# EAGLE design dcmotor_controller (EAGLE 9.0.0)
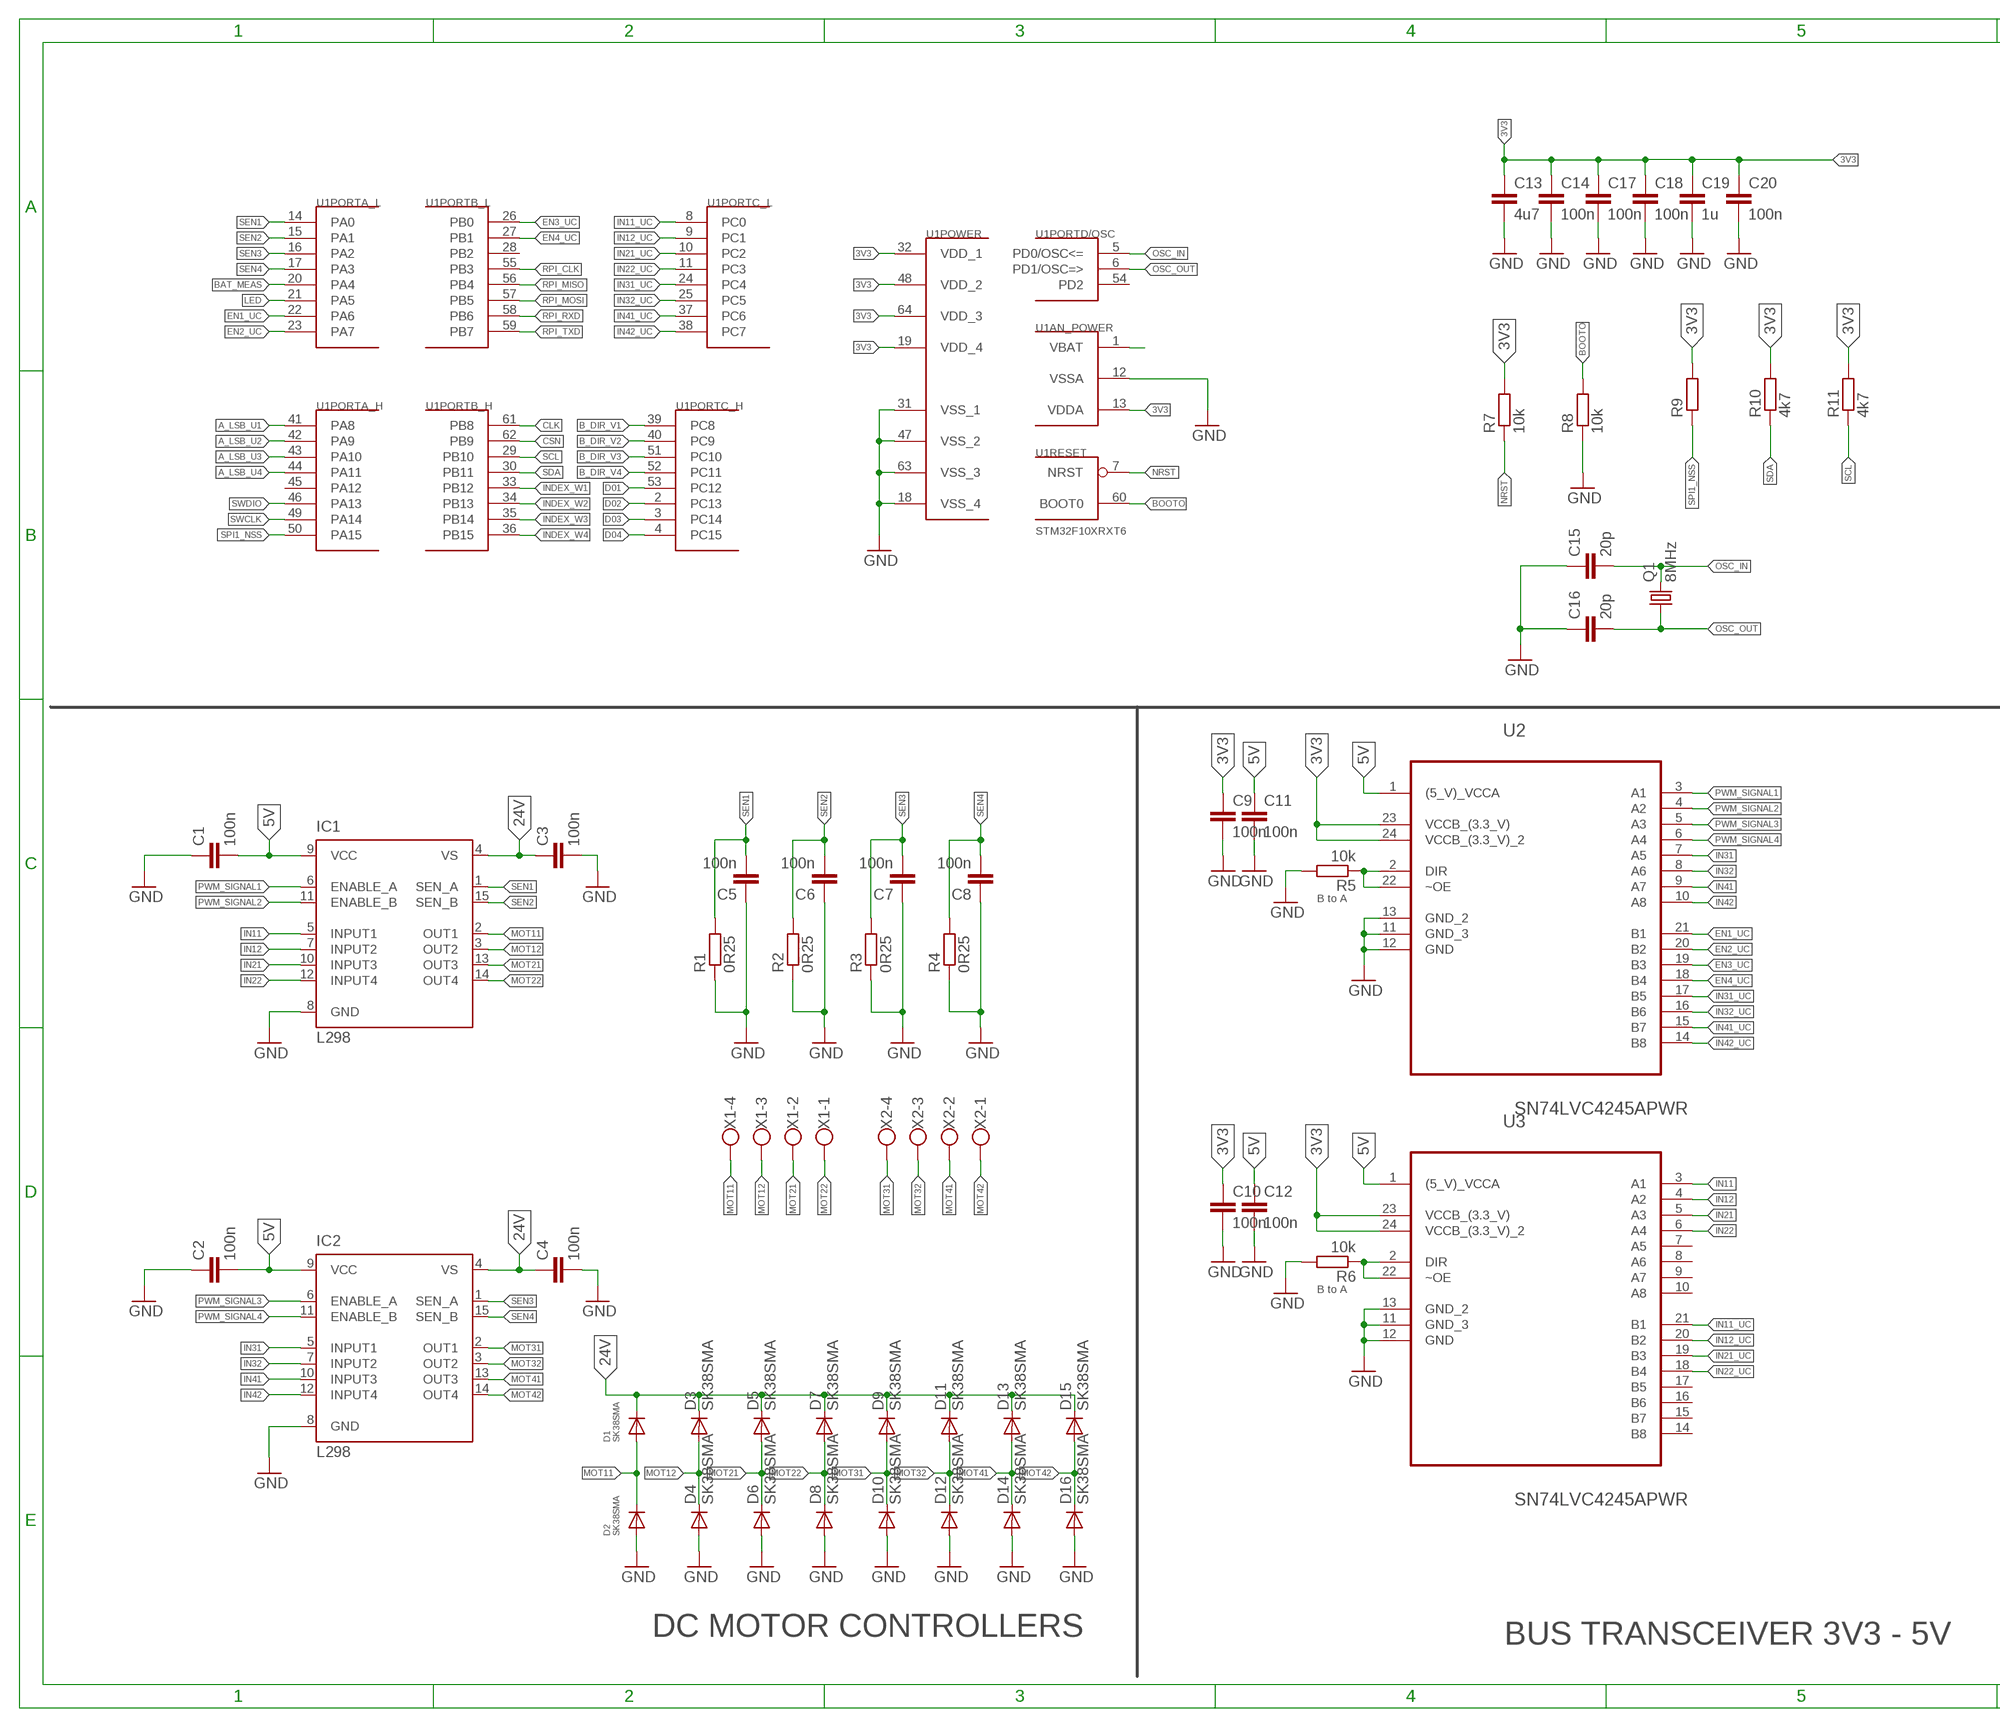
[diagram p0: schematic, sheet 1, part 1 of 2]
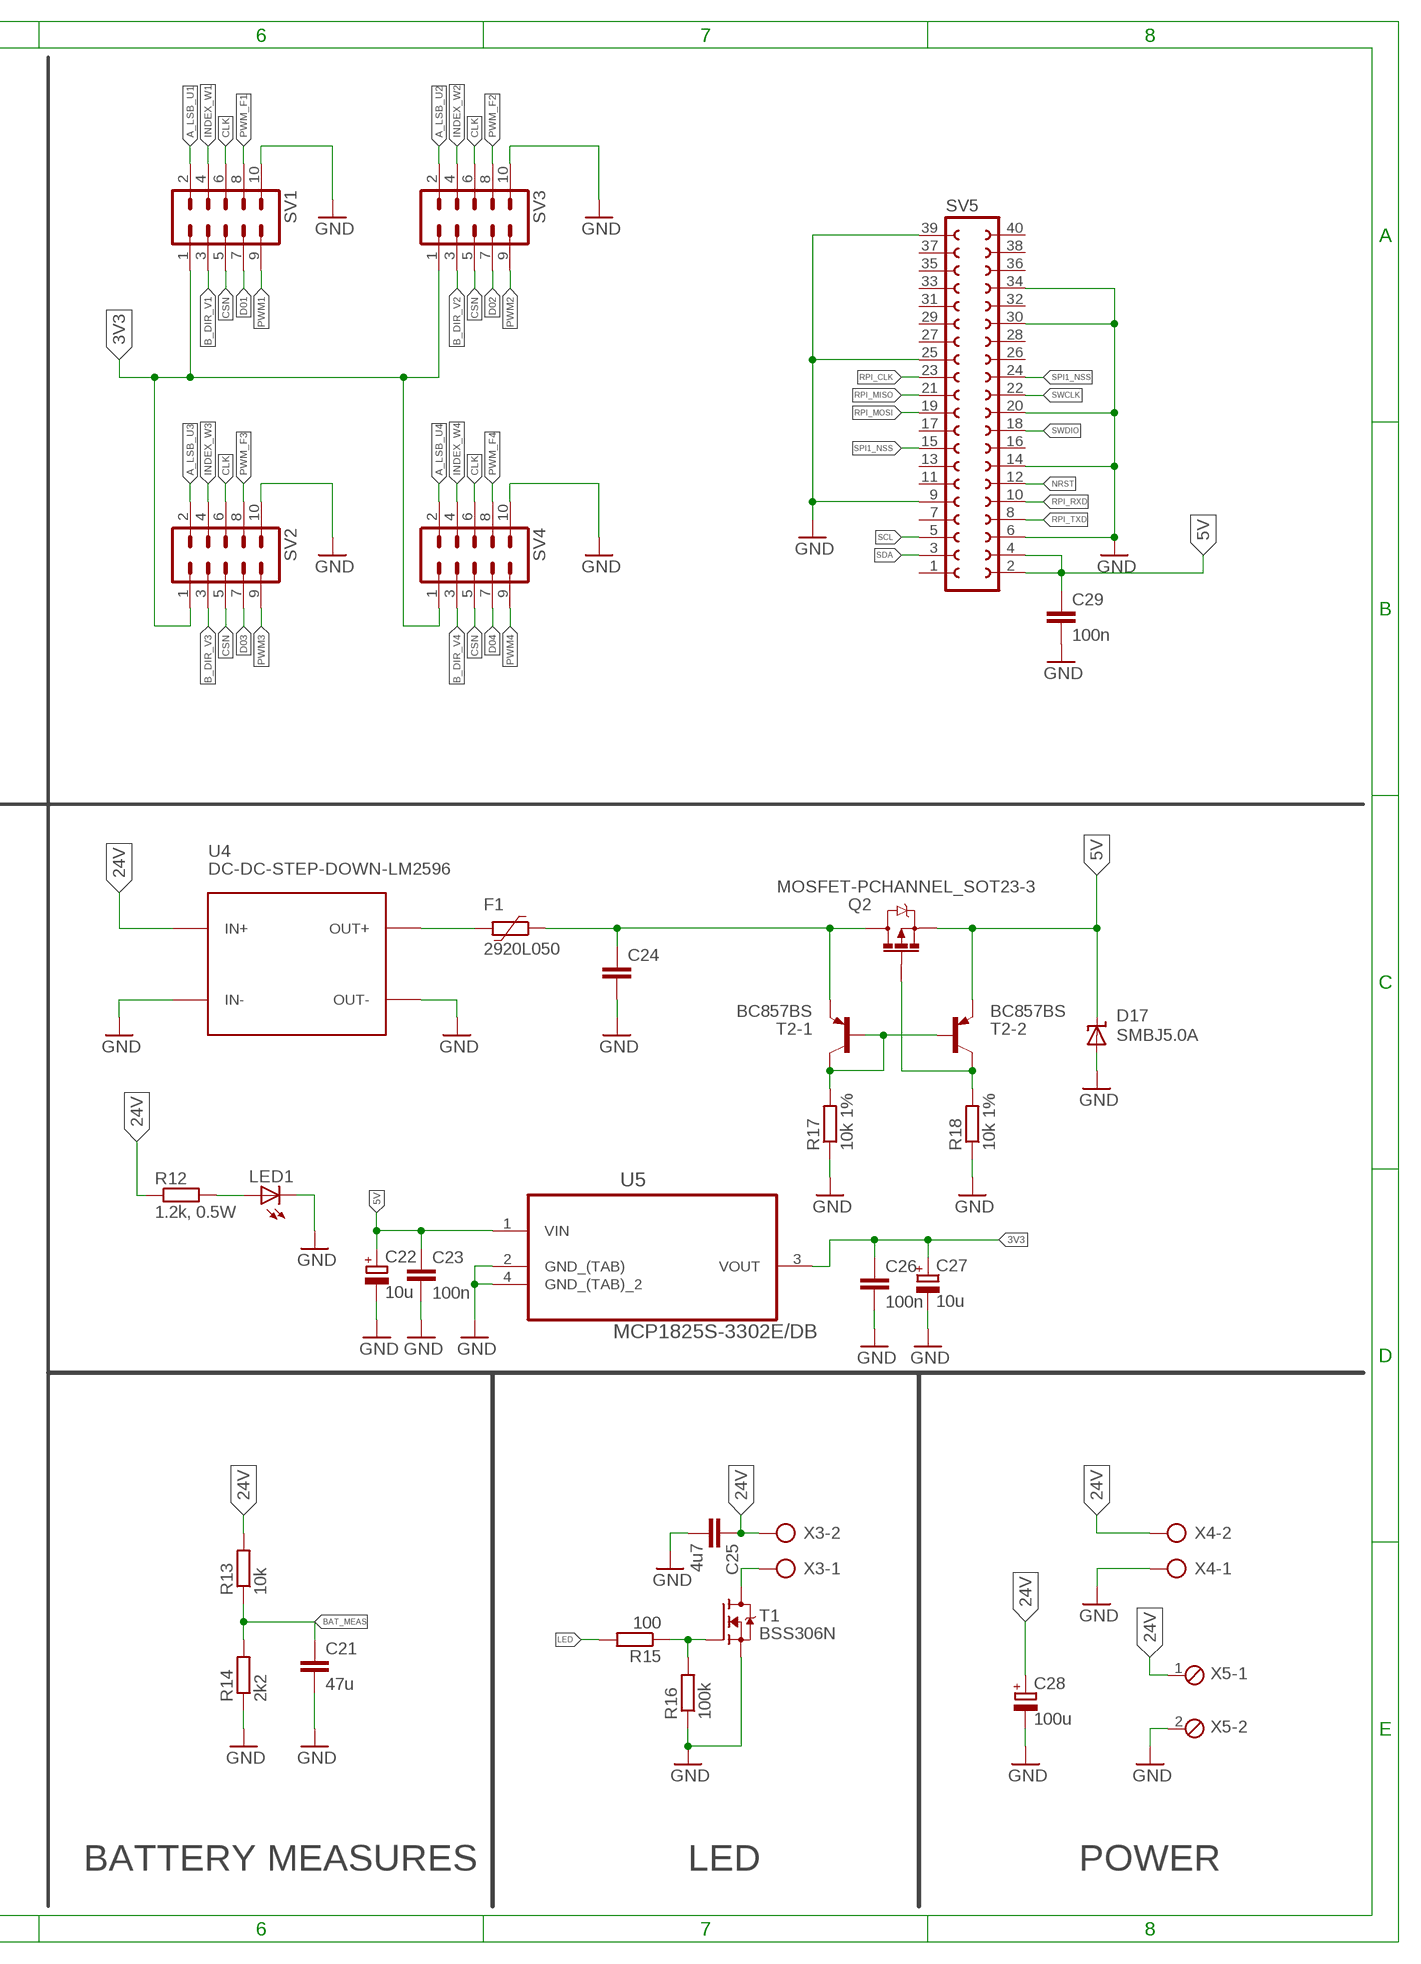
[diagram p1: schematic, sheet 1, part 2 of 2]

## Parts
C1  100n  C-EUC0805  [C0805]
C2  100n  C-EUC0805  [C0805]
C3  100n  C-EUC0805  [C0805]
C4  100n  C-EUC0805  [C0805]
C5  100n  C-EUC0805  [C0805]
C6  100n  C-EUC0805  [C0805]
C7  100n  C-EUC0805  [C0805]
C8  100n  C-EUC0805  [C0805]
C9  100n  C-EUC0805  [C0805]
C10  100n  C-EUC0805  [C0805]
C11  100n  C-EUC0805  [C0805]
C12  100n  C-EUC0805  [C0805]
C13  4u7  C-EUC0805  [C0805]
C14  100n  C-EUC0805  [C0805]
C15  20p  C-EUC0805  [C0805]
C16  20p  C-EUC0805  [C0805]
C17  100n  C-EUC0805  [C0805]
C18  100n  C-EUC0805  [C0805]
C19  1u  C-EUC0805  [C0805]
C20  100n  C-EUC0805  [C0805]
C21  47u  C-EUC0805  [C0805]
C22  10u  CPOL-EU153CLV-0807  [153CLV-0807]
C23  100n  C-EUC0805  [C0805]
C24  C-EUC0805  [C0805]
C25  4u7  C-EUC0805  [C0805]
C26  100n  C-EUC0805  [C0805]
C27  10u  CPOL-EU153CLV-0807  [153CLV-0807]
C28  100u  CPOL-EU153CLV-0807  [153CLV-0807]
C29  100n  C-EUC0805  [C0805]
D1  SK38SMA  DIODE-DO214AC  [DO214AC]
D2  SK38SMA  DIODE-DO214AC  [DO214AC]
D3  SK38SMA  DIODE-DO214AC  [DO214AC]
D4  SK38SMA  DIODE-DO214AC  [DO214AC]
D5  SK38SMA  DIODE-DO214AC  [DO214AC]
D6  SK38SMA  DIODE-DO214AC  [DO214AC]
D7  SK38SMA  DIODE-DO214AC  [DO214AC]
D8  SK38SMA  DIODE-DO214AC  [DO214AC]
D9  SK38SMA  DIODE-DO214AC  [DO214AC]
D10  SK38SMA  DIODE-DO214AC  [DO214AC]
D11  SK38SMA  DIODE-DO214AC  [DO214AC]
D12  SK38SMA  DIODE-DO214AC  [DO214AC]
D13  SK38SMA  DIODE-DO214AC  [DO214AC]
D14  SK38SMA  DIODE-DO214AC  [DO214AC]
D15  SK38SMA  DIODE-DO214AC  [DO214AC]
D16  SK38SMA  DIODE-DO214AC  [DO214AC]
D17  SMBJ5.0A  SUPPRESSOR-SMBJ  [SMBJ]
F1  2920L050  [2920L]
IC1  L298  [MULTIWATT-15]
IC2  L298  [MULTIWATT-15]
LED1  LEDCHIPLED_0805  [CHIPLED_0805]
Q1  8MHz  CSM-7X-DU  [CSM-7X-DU]
Q2  MOSFET-PCHANNEL_SOT23-3  [SOT23-3]
R1  0R25  R-EU_R2512  [R2512]
R2  0R25  R-EU_R2512  [R2512]
R3  0R25  R-EU_R2512  [R2512]
R4  0R25  R-EU_R2512  [R2512]
R5  10k  R-EU_M0805  [M0805]
R6  10k  R-EU_M0805  [M0805]
R7  10k  R-EU_R0805  [R0805]
R8  10k  R-EU_R0805  [R0805]
R9  R-EU_R0805  [R0805]
R10  4k7  R-EU_R0805  [R0805]
R11  4k7  R-EU_R0805  [R0805]
R12  1.2k, 0.5W  R-EU_R2010  [R2010]
R13  10k  R-EU_M0805  [M0805]
R14  2k2  R-EU_M0805  [M0805]
R15  100  R-EU_M0805  [M0805]
R16  100k  R-EU_M0805  [M0805]
R17  10k 1%  R-EU_M0805  [M0805]
R18  10k 1%  R-EU_M0805  [M0805]
SV1  ML10L  [ML10L]
SV2  ML10L  [ML10L]
SV3  ML10L  [ML10L]
SV4  ML10L  [ML10L]
SV5  FE20-2  [FE20-2]
T1  BSS306N  MOSFET-N-SOT23  [SOT23]
T2  BC857BS  [SOT363]
U1  STM32F10XRXT6  [TQFP64]
U2  SN74LVC4245APWR  [SOP65P640X120-24N]
U3  SN74LVC4245APWR  [SOP65P640X120-24N]
U4  DC-DC-STEP-DOWN-LM2596  [DC-DC-STEP-DOWN-LM2596]
U5  MCP1825S-3302E/DB  [SOT230P700X180-4N]
X1  W237-4  [W237-4]
X2  W237-4  [W237-4]
X3  AK500/2  [AK500/2]
X4  AK500/2  [AK500/2]
X5  MPT2  [2POL254]

## Nets
3V3: C9.1 C10.1 C13.1 C14.1 C17.1 C18.1 C19.1 C20.1 C26.1 C27.+ R7.2 R9.2 R10.2 R11.2 SV1.1 SV2.1 SV3.1 SV4.1 U1.13(AN_POWER:VDDA) U1.19(POWER:VDD_4) U1.32(POWER:VDD_1) U1.48(POWER:VDD_2) U1.64(POWER:VDD_3) U2.23(VCCB_(3.3_V)) U2.24(VCCB_(3.3_V)_2) U3.23(VCCB_(3.3_V)) U3.24(VCCB_(3.3_V)_2) U5.3(VOUT)
5V: C1.2 C2.2 C11.1 C12.1 C22.+ C23.1 C29.1 D17.C IC1.9(VCC) IC2.9(VCC) Q2.2(S) SV5.2 SV5.4 T2.4(-2:E) U2.1((5_V)_VCCA) U3.1((5_V)_VCCA) U5.1(VIN)
24V: C3.1 C4.1 C25.1 C28.+ D1.C D3.C D5.C D7.C D9.C D11.C D13.C D15.C IC1.4(VS) IC2.4(VS) R12.1 R13.2 U4.IN+ X3.2 X4.2 X5.1
A_LSB_U1: SV1.2 U1.41(PORTA_H:PA8)
A_LSB_U2: SV3.2 U1.42(PORTA_H:PA9)
A_LSB_U3: SV2.2 U1.43(PORTA_H:PA10)
A_LSB_U4: SV4.2 U1.44(PORTA_H:PA11)
B_DIR_V1: SV1.3 U1.39(PORTC_H:PC8)
B_DIR_V2: SV3.3 U1.40(PORTC_H:PC9)
B_DIR_V3: SV2.3 U1.51(PORTC_H:PC10)
B_DIR_V4: SV4.3 U1.52(PORTC_H:PC11)
BAT_MEAS: C21.1 R13.1 R14.2 U1.20(PORTA_L:PA4)
BOOTO: R8.2 U1.60(RESET:BOOT0)
CLK: SV1.6 SV2.6 SV3.6 SV4.6 U1.61(PORTB_H:PB8)
CSN: SV1.5 SV2.5 SV3.5 SV4.5 U1.62(PORTB_H:PB9)
D01: SV1.7 U1.53(PORTC_H:PC12)
D02: SV3.7 U1.2(PORTC_H:PC13)
D03: SV2.7 U1.3(PORTC_H:PC14)
D04: SV4.7 U1.4(PORTC_H:PC15)
EN1_UC: U1.22(PORTA_L:PA6) U2.21(B1)
EN2_UC: U1.23(PORTA_L:PA7) U2.20(B2)
EN3_UC: U1.26(PORTB_L:PB0) U2.19(B3)
EN4_UC: U1.27(PORTB_L:PB1) U2.18(B4)
GND: C1.1 C2.1 C3.2 C4.2 C5.1 C6.1 C7.1 C8.1 C9.2 C10.2 C11.2 C12.2 C13.2 C14.2 C15.1 C16.1 C17.2 C18.2 C19.2 C20.2 C21.2 C22.- C23.2 C24.2 C25.2 C26.2 C27.- C28.- C29.2 D2.A D4.A D6.A D8.A D10.A D12.A D14.A D16.A D17.A IC1.8(GND) IC2.8(GND) LED1.C R1.1 R2.1 R3.1 R4.1 R5.2 R6.2 R8.1 R14.1 R16.1 R17.1 R18.1 SV1.10 SV2.10 SV3.10 SV4.10 SV5.6 SV5.9 SV5.14 SV5.20 SV5.25 SV5.30 SV5.34 SV5.39 T1.2(S) U1.12(AN_POWER:VSSA) U1.18(POWER:VSS_4) U1.31(POWER:VSS_1) U1.47(POWER:VSS_2) U1.63(POWER:VSS_3) U2.11(GND_3) U2.12(GND) U2.13(GND_2) U3.11(GND_3) U3.12(GND) U3.13(GND_2) U4.IN- U4.OUT- U5.2(GND_(TAB)) U5.4(GND_(TAB)_2) X4.1 X5.2
IN11: IC1.5(INPUT1) U3.3(A1)
IN11_UC: U1.8(PORTC_L:PC0) U3.21(B1)
IN12: IC1.7(INPUT2) U3.4(A2)
IN12_UC: U1.9(PORTC_L:PC1) U3.20(B2)
IN21: IC1.10(INPUT3) U3.5(A3)
IN21_UC: U1.10(PORTC_L:PC2) U3.19(B3)
IN22: IC1.12(INPUT4) U3.6(A4)
IN22_UC: U1.11(PORTC_L:PC3) U3.18(B4)
IN31: IC2.5(INPUT1) U2.7(A5)
IN31_UC: U1.24(PORTC_L:PC4) U2.17(B5)
IN32: IC2.7(INPUT2) U2.8(A6)
IN32_UC: U1.25(PORTC_L:PC5) U2.16(B6)
IN41: IC2.10(INPUT3) U2.9(A7)
IN41_UC: U1.37(PORTC_L:PC6) U2.15(B7)
IN42: IC2.12(INPUT4) U2.10(A8)
IN42_UC: U1.38(PORTC_L:PC7) U2.14(B8)
INDEX_W1: SV1.4 U1.33(PORTB_H:PB12)
INDEX_W2: SV3.4 U1.34(PORTB_H:PB13)
INDEX_W3: SV2.4 U1.35(PORTB_H:PB14)
INDEX_W4: SV4.4 U1.36(PORTB_H:PB15)
LED: R15.2 U1.21(PORTA_L:PA5)
MOT11: D1.A D2.C IC1.2(OUT1) X1.4
MOT12: D3.A D4.C IC1.3(OUT2) X1.3
MOT21: D5.A D6.C IC1.13(OUT3) X1.2
MOT22: D7.A D8.C IC1.14(OUT4) X1.1
MOT31: D9.A D10.C IC2.2(OUT1) X2.4
MOT32: D11.A D12.C IC2.3(OUT2) X2.3
MOT41: D13.A D14.C IC2.13(OUT3) X2.2
MOT42: D15.A D16.C IC2.14(OUT4) X2.1
N$1: F1.2 U4.OUT+
N$3: LED1.A R12.2
N$4: R5.1 U2.2(DIR) U2.22(~OE)
N$5: R6.1 U3.2(DIR) U3.22(~OE)
N$6: C24.1 F1.1 Q2.3(D) T2.1(-1:E)
N$16: U1.1(AN_POWER:VBAT)
N$19: Q2.1(G) R18.2 T2.3(-2:C)
N$20: R17.2 T2.2(-1:B) T2.5(-2:B) T2.6(-1:C)
N$21: R15.1 R16.2 T1.1(G)
N$24: T1.3(D) X3.1
NRST: R7.1 SV5.12 U1.7(RESET:NRST)
OSC_IN: C15.2 Q1.2 U1.5(PORTD/OSC:PD0/OSC<=)
OSC_OUT: C16.2 Q1.1 U1.6(PORTD/OSC:PD1/OSC=>)
PWM1: SV1.9
PWM2: SV3.9
PWM3: SV2.9
PWM4: SV4.9
PWM_F1: SV1.8
PWM_F2: SV3.8
PWM_F3: SV2.8
PWM_F4: SV4.8
PWM_SIGNAL1: IC1.6(ENABLE_A) U2.3(A1)
PWM_SIGNAL2: IC1.11(ENABLE_B) U2.4(A2)
PWM_SIGNAL3: IC2.6(ENABLE_A) U2.5(A3)
PWM_SIGNAL4: IC2.11(ENABLE_B) U2.6(A4)
RPI_CLK: SV5.23 U1.55(PORTB_L:PB3)
RPI_MISO: SV5.21 U1.56(PORTB_L:PB4)
RPI_MOSI: SV5.19 U1.57(PORTB_L:PB5)
RPI_RXD: SV5.10 U1.58(PORTB_L:PB6)
RPI_TXD: SV5.8 U1.59(PORTB_L:PB7)
SCL: R11.1 SV5.5 U1.29(PORTB_H:PB10)
SDA: R10.1 SV5.3 U1.30(PORTB_H:PB11)
SEN1: C5.2 IC1.1(SEN_A) R1.2 U1.14(PORTA_L:PA0)
SEN2: C6.2 IC1.15(SEN_B) R2.2 U1.15(PORTA_L:PA1)
SEN3: C7.2 IC2.1(SEN_A) R3.2 U1.16(PORTA_L:PA2)
SEN4: C8.2 IC2.15(SEN_B) R4.2 U1.17(PORTA_L:PA3)
SPI1_NSS: R9.1 SV5.15 SV5.24 U1.50(PORTA_H:PA15)
SWCLK: SV5.22 U1.49(PORTA_H:PA14)
SWDIO: SV5.18 U1.46(PORTA_H:PA13)
Unconnected: SV5.1 SV5.7 SV5.11 SV5.13 SV5.16 SV5.17 SV5.26 SV5.27 SV5.28 SV5.29 SV5.31 SV5.32 SV5.33 SV5.35 SV5.36 SV5.37 SV5.38 SV5.40 U1.28(PORTB_L:PB2) U1.45(PORTA_H:PA12) U1.54(PORTD/OSC:PD2) U3.7(A5) U3.8(A6) U3.9(A7) U3.10(A8) U3.14(B8) U3.15(B7) U3.16(B6) U3.17(B5)

## Notes on the sheet
- B to A
- B to A
- DC MOTOR CONTROLLERS | BUS TRANSCEIVER 3V3 - 5V | BATTERY MEASURES | LED | POWER

## Library data of the parts
C1 C3 C13-C20 C24 = rcl:C-EU: CAPACITOR, European symbol; SPICEPREFIX: C
C2 C4-C12 C25 C29 = resistor:C-EU: CAPACITOR, European symbol
C21 C23 C26 = resistor:C-EU: CAPACITOR, European symbol; LINK: http://www.tme.eu/pl/details/cl21a476mqynnng/kondensatory-mlcc-smd-0805/samsung/
C22 C27 C28 = resistor:CPOL-EU: POLARIZED CAPACITOR, European symbol; LINK: http://www.tme.eu/pl/details/sc1e107m0806bvr/kondensatory-elektrolityczne-smd-85c/samwha/
D1-D16 = diode:DIODE-: DIODE; LINK: http://www.tme.eu/pl/details/sk38sma-dio/diody-schottky-smd/diotec-semiconductor/sk38sma/
D17 = diode:SUPPRESSOR-: Suppressor diode
F1 = polyfuse-smd_10:?: Polyfuse Resettable PTC Source: http://www.littelfuse.com/products/resettable-ptcs.aspx; MF: Littelfuse; MPN: 2920L050; OC_FARNELL: 1822223; OC_NEWARK: 18M4790
IC1 IC2 = st-microelectronics:L298: DUAL FULL-BRIDGE DRIVER; MPN: L298N; OC_FARNELL: 1589425; OC_NEWARK: 32M1527
LED1 = led:LED: LED OSRAM: - CHIPLED LG R971, LG N971, LY N971, LG Q971, LY Q971, LO R971, LY R971 LH N974, LH R974 LS Q976, LO Q976, LY Q976 LO Q996 - Hyper CHIPLED LW Q18S LB Q993, LB Q99A, LB R99A - SideLED LS A670, LO A670, LY A670, LG A670, LP A670 LB A673, LV A673, LT A673, LW A673 LH A674 LY A675 LS A676, LA A676, LO A676, LY A676, LW A676 LS A679, LY A679, LG A679 - Hyper Micro SIDELED® LS Y876, LA Y876, LO Y876, LY Y876 LT Y87S - SmartLED LW L88C, LW L88S LB L89C, LB L89S, LG L890 LS L89K, LO L89K, LY L89K LS L896, LA L896, LO L896, LY L896 - TOPLED LS T670, LO T670, LY T670, LG T670, LP T670 LSG T670, LSP T670, LSY T670, LOP T670, LYG T670 LG T671, LOG T671, LSG T671 LB T673, LV T673, LT T673, LW T673 LH T674 LS T676, LA T676, LO T676, LY T676, LB T676, LH T676, LSB T676, LW T676 LB T67C, LV T67C, LT T67C, LS T67K, LO T67K, LY T67K, LW E67C LS E67B, LA E67B, LO E67B, LY E67B, LB E67C, LV E67C, LT E67C LW T67C LS T679, LY T679, LG T679 LS T770, LO T770, LY T770, LG T770, LP T770 LB T773, LV T773, LT T773, LW T773 LH T774 LS E675, LA E675, LY E675, LS T675 LS T776, LA T776, LO T776, LY T776, LB T776 LHGB T686 LT T68C, LB T68C - Hyper Mini TOPLED® LB M676 - Mini TOPLED Santana® LG M470 LS M47K, LO M47K, LY M47K Source: http://www.osram.convergy.de LUXEON: - LUMILED® LXK2-PW12-R00, LXK2-PW12-S00, LXK2-PW14-U00, LXK2-PW14-V00 LXK2-PM12-R00, LXK2-PM12-S00, LXK2-PM14-U00 LXK2-PE12-Q00, LXK2-PE12-R00, LXK2-PE12-S00, LXK2-PE14-T00, LXK2-PE14-U00 LXK2-PB12-K00, LXK2-PB12-L00, LXK2-PB12-M00, LXK2-PB14-N00, LXK2-PB14-P00, LXK2-PB14-Q00 LXK2-PR12-L00, LXK2-PR12-M00, LXK2-PR14-Q00, LXK2-PR14-R00 LXK2-PD12-Q00, LXK2-PD12-R00, LXK2-PD12-S00 LXK2-PH12-R00, LXK2-PH12-S00 LXK2-PL12-P00, LXK2-PL12-Q00, LXK2-PL12-R00 Source: www.luxeon.com KINGBRIGHT: KA-3528ASYC Source: www.kingbright.com
Q1 = crystal:CSM-7X-DU: SMD CRYSTAL Source: www.ecsxtal.com .. Crystal 3.6864MHz CSM_7X_DU.PDF; OC_FARNELL: unknown; OC_NEWARK: unknown
Q2 = Simplex-DiscreteSemi:MOSFET-PCHANNEL: Generic P-channel mosfet
R1-R4 = rcl:R-EU_: RESISTOR, European symbol; LINK: http://www.tme.eu/pl/details/cs2512-0r25-1%25-hp/rezystory-smd-2512/viking/cs12ftfsr250/
R5 R6 R13-R18 = resistor:R-EU_: RESISTOR, European symbol
R7-R12 = rcl:R-EU_: RESISTOR, European symbol; SPICEPREFIX: R
SV1-SV4 = con-ml:ML10L: HARTING; OC_FARNELL: unknown; OC_NEWARK: unknown
SV5 = con-lsta:FE20-2: FEMALE HEADER; OC_FARNELL: unknown; OC_NEWARK: unknown
T1 = we-transistor:MOSFET-N: N-Channel MOSFET (e.g. IRLML2502, BSS138)
T2 = NXP_60_26022015:BC857BS: PNP double transistor in an SC-88; SOT363 plastic package. AAL Eindhoven MK
U1 = stm32:STM32F10XRXT6: STM32F101/103 64pin LQFP
U2 U3 = Texas Instruments_By_element14_Batch_1:SN74LVC4245APWR: OCTAL BUS TRANSCEIVER AND 3.3-V TO 5-V SHIFTER WITH 3-STATE OUTPUTS; MPN: SN74LVC4245APWR; OC_FARNELL: 1470935; OC_NEWARK: 92B8894; PACKAGE: TSSOP-24; SUPPLIER: Texas Instruments
U4 = lm2596:DC-DC-STEP-DOWN-LM2596: DC/DC Step-Down Regulator based on LM2596-ADJ chip LM2596 datasheet available here: http://www.ti.com/lit/ds/symlink/lm2596.pdf Click here to find device on ebay.com <http://www.ebay.com/sch/lm2596+power+regulator>
U5 = MCP1825S-3302E_DB:MCP1825S-3302E/DB: IC, LDO VOLT REG, 3.3V, 0.5A; AVAILABILITY: Good; DESCRIPTION: MCP1825 Series 500 mA Low Quiescent Current LDO Regulator - SOT-223-3; MF: Microchip; MP: MCP1825S-3302E/DB; PACKAGE: SOT-223-3 Microchip; PRICE: 0.50 USD
X1 X2 = con-wago-500:W237-4: WAGO SCREW CLAMP; OC_FARNELL: unknown; OC_NEWARK: unknown
X3 X4 = con-ptr500:AK500/2: CONNECTOR; OC_FARNELL: unknown; OC_NEWARK: unknown
X5 = con-phoenix-254:MPT2: PHOENIX CONNECTOR; OC_FARNELL: unknown; OC_NEWARK: unknown

## Board
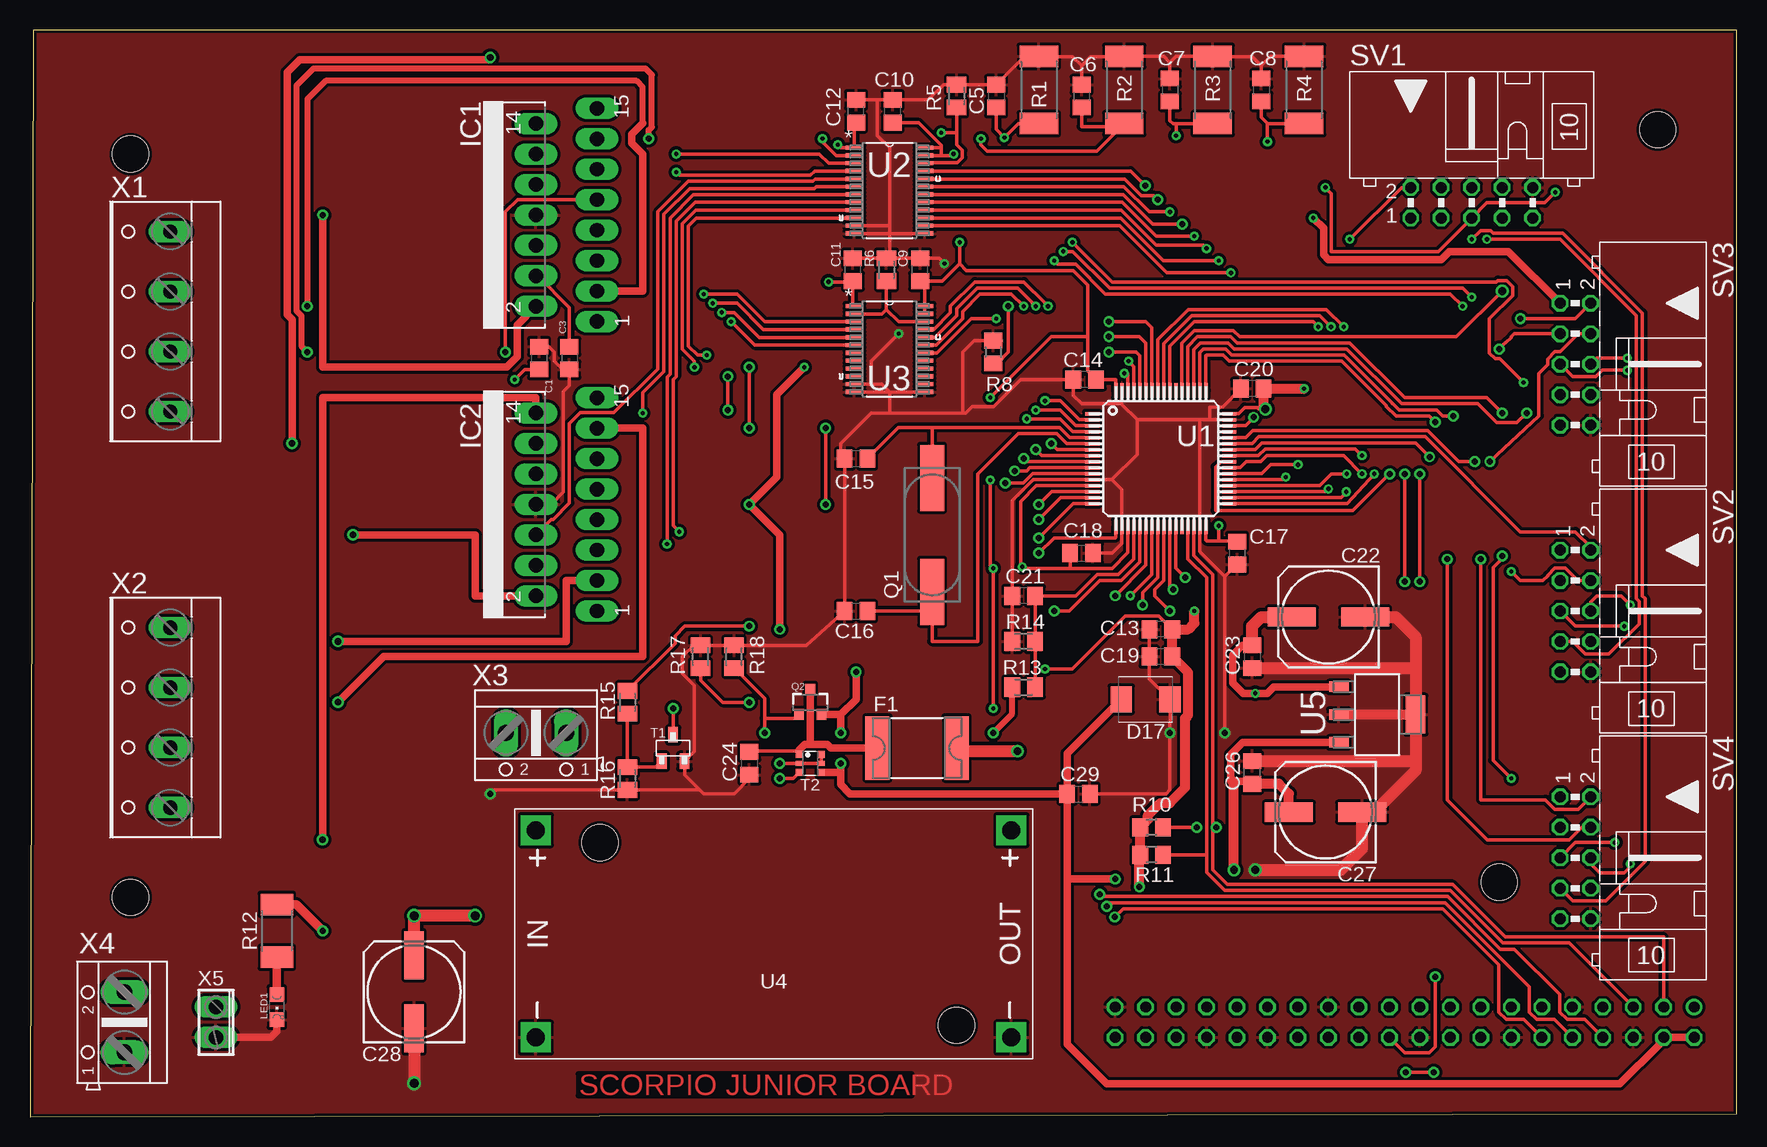
[diagram p2: board, top side]
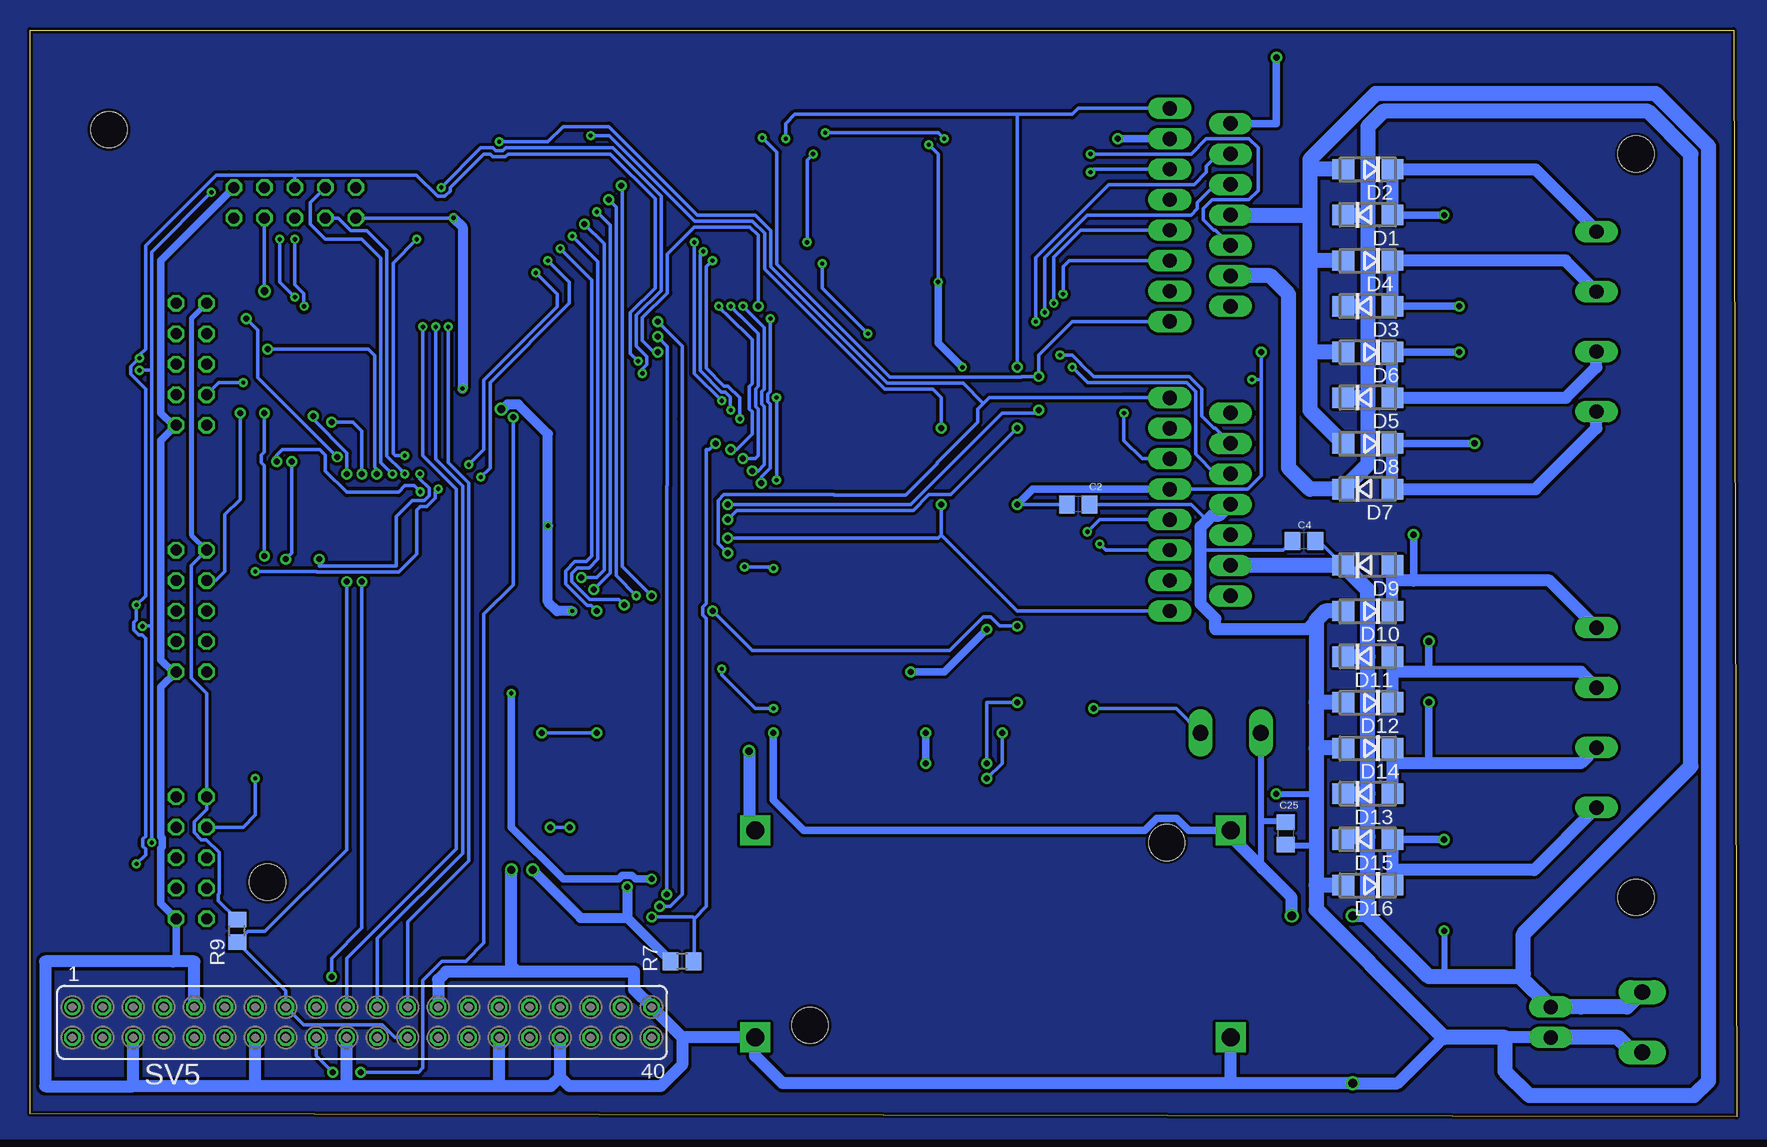
[diagram p3: board, bottom side, seen from below]

Size 142.22 x 90.6 mm. Coordinates in mm from the lower left corner, seen from the top.
Outline: 0,0 142.22,0.25 142.22,90.6 0.25,90.6 0,0
Copper layers (1*16): Top 0.035mm / dielectric 1.5mm / Bottom 0.035mm
Design rules "DRC-Scorpio": minimum track width 8mil, minimum drill 11mil, track to track 8mil, track to pad 8mil, pad to pad 8mil, via to via 8mil, smd to smd 8mil, copper to edge 8mil, drill to drill 8mil, minimum pad ring 8mil, minimum via ring 8mil, stop-mask expansion 4mil, vias tented up to drill 0mil, thermal gap 10mil
Holes 3 mm at 8.38,80.26 8.38,18.29 135.64,82.3 122.43,19.56

### Footprints (pad centres in the part's own frame; a part is rotated, then mirrored left to right if it is on the bottom)
C0805 = smd 1.3 x 1.5: 1 -0.95,0; 2 0.95,0
153CLV-0807 = smd 4 x 1.6: + 3.05,0; - -3.05,0
DO214AC = smd 1.8 x 1.7: A 2.05,0; C -2.05,0
SMBJ = smd 1.78 x 2.16: A 2.04,0; C -2.03,0
2920L = smd 2 x 5.3: 1 -3.3,0; 2 3.3,0
MULTIWATT-15 = drill 1.2 long: 1 -8.89,-7.62; 2 -7.62,-2.54; 3 -6.35,-7.62; 4 -5.08,-2.54; 5 -3.81,-7.62; 6 -2.54,-2.54; 7 -1.27,-7.62; 8 0,-2.54; 9 1.27,-7.62; 10 2.54,-2.54; 11 3.81,-7.62; 12 5.08,-2.54; 13 6.35,-7.62; 14 7.62,-2.54; 15 8.89,-7.62
CHIPLED_0805 = smd 1.2 x 1.2: A 0,-1.05; C 0,1.05
CSM-7X-DU = smd 5.5 x 2: 1 -4.75,0; 2 4.75,0
SOT23-3 = smd 0.8 x 0.9: 1 -0.95,-1; 2 0.95,-1; 3 0,1.1
R2512 = smd 1.8 x 3.2: 1 -2.8,0; 2 2.8,0
M0805 = smd 1.3 x 1.6: 1 -0.95,0; 2 0.95,0
R0805 = smd 1.3 x 1.5: 1 -0.95,0; 2 0.95,0
R2010 = smd 1.8 x 2.7: 1 -2.2,0; 2 2.2,0
ML10L = drill 0.914 octagon: 1 -5.08,-1.27; 2 -5.08,1.27; 3 -2.54,-1.27; 4 -2.54,1.27; 5 0,-1.27; 6 0,1.27; 7 2.54,-1.27; 8 2.54,1.27; 9 5.08,-1.27; 10 5.08,1.27
FE20-2 = drill 0.914: 1 -24.13,1.27 | drill 0.914 octagon: 2 -24.13,-1.27; 3 -21.59,1.27; 4 -21.59,-1.27; 5 -19.05,1.27; 6 -19.05,-1.27; 7 -16.51,1.27; 8 -16.51,-1.27; 9 -13.97,1.27; 10 -13.97,-1.27; 11 -11.43,1.27; 12 -11.43,-1.27; 13 -8.89,1.27; 14 -8.89,-1.27; 15 -6.35,1.27; 16 -6.35,-1.27; 17 -3.81,1.27; 18 -3.81,-1.27; 19 -1.27,1.27; 20 -1.27,-1.27; 21 1.27,1.27; 22 1.27,-1.27; 23 3.81,1.27; 24 3.81,-1.27; 25 6.35,1.27; 26 6.35,-1.27; 27 8.89,1.27; 28 8.89,-1.27; 29 11.43,1.27; 30 11.43,-1.27; 31 13.97,1.27; 32 13.97,-1.27; 33 16.51,1.27; 34 16.51,-1.27; 35 19.05,1.27; 36 19.05,-1.27; 37 21.59,1.27; 38 21.59,-1.27; 39 24.13,1.27; 40 24.13,-1.27
SOT23 = smd 1.3 x 0.9: 1 -1.1,0.95; 2 -1.1,-0.95; 3 1.1,0
SOT363 = smd 0.6 x 0.6: 1 -0.75,-0.9; 3 0.75,-0.9; 4 0.75,0.9; 6 -0.75,0.9 | smd 0.4 x 0.6: 2 0,-0.9; 5 0,0.9
TQFP64 = smd 1.2 x 0.3: 1 -5.7,3.75; 2 -5.7,3.25; 3 -5.7,2.75; 4 -5.7,2.25; 5 -5.7,1.75; 6 -5.7,1.25; 7 -5.7,0.75; 8 -5.7,0.25; 9 -5.7,-0.25; 10 -5.7,-0.75; 11 -5.7,-1.25; 12 -5.7,-1.75; 13 -5.7,-2.25; 14 -5.7,-2.75; 15 -5.7,-3.25; 16 -5.7,-3.75; 33 5.7,-3.75; 34 5.7,-3.25; 35 5.7,-2.75; 36 5.7,-2.25; 37 5.7,-1.75; 38 5.7,-1.25; 39 5.7,-0.75; 40 5.7,-0.25; 41 5.7,0.25; 42 5.7,0.75; 43 5.7,1.25; 44 5.7,1.75; 45 5.7,2.25; 46 5.7,2.75; 47 5.7,3.25; 48 5.7,3.75 | smd 0.3 x 1.2: 17 -3.75,-5.7; 18 -3.25,-5.7; 19 -2.75,-5.7; 20 -2.25,-5.7; 21 -1.75,-5.7; 22 -1.25,-5.7; 23 -0.75,-5.7; 24 -0.25,-5.7; 25 0.25,-5.7; 26 0.75,-5.7; 27 1.25,-5.7; 28 1.75,-5.7; 29 2.25,-5.7; 30 2.75,-5.7; 31 3.25,-5.7; 32 3.75,-5.7; 49 3.75,5.7; 50 3.25,5.7; 51 2.75,5.7; 52 2.25,5.7; 53 1.75,5.7; 54 1.25,5.7; 55 0.75,5.7; 56 0.25,5.7; 57 -0.25,5.7; 58 -0.75,5.7; 59 -1.25,5.7; 60 -1.75,5.7; 61 -2.25,5.7; 62 -2.75,5.7; 63 -3.25,5.7; 64 -3.75,5.7
SOP65P640X120-24N = smd 1.473 x 0.356: 1 -2.921,3.581; 2 -2.921,2.921; 3 -2.921,2.286; 4 -2.921,1.626; 5 -2.921,0.965; 6 -2.921,0.33; 7 -2.921,-0.33; 8 -2.921,-0.965; 9 -2.921,-1.626; 10 -2.921,-2.286; 11 -2.921,-2.921; 12 -2.921,-3.581; 13 2.921,-3.581; 14 2.921,-2.921; 15 2.921,-2.286; 16 2.921,-1.626; 17 2.921,-0.965; 18 2.921,-0.33; 19 2.921,0.33; 20 2.921,0.965; 21 2.921,1.626; 22 2.921,2.286; 23 2.921,2.921; 24 2.921,3.581
DC-DC-STEP-DOWN-LM2596 = drill 1.5 pad 2.5 square: IN+ -19.812,8.636; IN- -19.812,-8.636; OUT+ 19.812,8.636; OUT- 19.812,-8.636 | hole 3: -14.478,7.62; 15.24,-7.62
SOT230P700X180-4N = smd 1.626 x 0.889: 1 -3.2,2.311; 2 -3.2,0; 3 -3.2,-2.311 | smd 1.626 x 3.175: 4 3.2,0
W237-4 = drill 1.194 long: 1 -7.5,-1.27; 2 -2.5,-1.27; 3 2.5,-1.27; 4 7.5,-1.27
AK500/2 = drill 1.321 long: 1 -2.515,0; 2 2.515,0
2POL254 = drill 1.2 long: 1 -1.27,0; 2 1.27,0

### Placement (x,y rotation side)
C1  42.42,63.25 270 top
C2  54.86,51.05 180 bottom
C3  44.96,63.25 270 top
C4  36.07,48.01 180 bottom
C5  80.52,85.09 270 top
C6  87.63,85.09 270 top
C7  95,85.6 270 top
C8  102.62,85.6 270 top
C9  74.17,70.61 90 top
C10  71.88,83.82 90 top
C11  68.58,70.61 90 top
C12  68.83,83.82 90 top
C13  94.23,40.64 180 top
C14  87.88,61.47 180 top
C15  68.83,54.86 0 top
C16  68.83,42.16 0 top
C17  100.58,46.99 270 top
C18  87.63,46.99 0 top
C19  94.23,38.35 180 top
C20  101.85,60.71 180 top
C21  82.8,43.43 180 top
C22  108.2,41.66 180 top
C23  101.85,38.35 270 top
C24  59.94,29.46 270 top
C25  37.59,23.62 270 bottom
C26  101.85,28.7 90 top
C27  107.95,25.4 180 top
C28  32,10.41 90 top
C29  87.38,26.92 0 top
D1  30.73,75.18 0 bottom
D2  30.73,78.99 180 bottom
D3  30.73,67.56 0 bottom
D4  30.73,71.37 180 bottom
D5  30.73,59.94 0 bottom
D6  30.73,63.75 180 bottom
D7  30.73,52.32 0 bottom
D8  30.73,56.13 180 bottom
D9  30.73,45.97 0 bottom
D10  30.73,42.16 180 bottom
D11  30.73,38.35 0 bottom
D12  30.73,34.54 180 bottom
D13  30.73,26.92 0 bottom
D14  30.73,30.73 180 bottom
D15  30.73,23.11 0 bottom
D16  30.73,19.3 180 bottom
D17  92.96,34.8 0 top
F1  73.91,30.73 0 top
IC1  39.62,75.18 90 top
IC2  39.62,51.05 90 top
LED1  20.57,9.14 180 top
Q1  75.18,48.51 90 top
Q2  65.02,34.54 0 top
R1  84.07,85.6 270 top
R2  91.19,85.6 270 top
R3  98.55,85.6 270 top
R4  106.17,85.6 270 top
R5  77.22,85.09 90 top
R6  71.37,70.61 90 top
R7  87.88,12.95 180 bottom
R8  80.26,63.75 270 top
R9  124.97,15.49 90 bottom
R10  93.47,24.13 180 top
R11  93.47,21.84 180 top
R12  20.57,15.49 270 top
R13  82.8,35.81 180 top
R14  82.8,39.62 0 top
R15  49.78,34.54 90 top
R16  49.78,28.19 90 top
R17  55.88,38.35 270 top
R18  58.67,38.35 270 top
SV1  120.14,76.2 0 top
SV2  128.78,42.16 270 top
SV3  128.78,62.74 270 top
SV4  128.78,21.59 270 top
SV5  114.55,7.87 0 bottom
T1  53.59,30.73 90 top
T2  65.02,29.46 270 top
U1  94.23,54.86 0 top
U2  71.63,77.22 0 top
U3  71.63,64.01 0 top
U4  61.98,15.24 0 top
U5  112.27,33.53 0 top
X1  10.41,66.29 90 top
X2  10.41,33.27 90 top
X3  42.16,32 180 top
X4  7.87,7.87 90 top
X5  15.49,7.87 270 top

### Tracks (layer width: path | path; a pad name or v marks a point on that pad's centre or on a via)
3V3  (via drill 0.35, 0.5, 0.65)
  Top 0.305: U1.64 90.48,61.47 C14.1 88.14,62.16 88.14,65.02 | U1.48 100.71,58.61 101.22,59.12 102.3,59.12 102.41,59 v102.95,59 | 91.48,48.3 U1.19 91.48,47.03 90.17,45.72 86.61,45.72 | U1.32 97.98,48.07 98.04,48.01 99.06,48.01 | 99.06,48.01 100.52,48.01 C17.1 | U1.13 83.86,52.61 82.55,51.31 82.55,45.97 v82.68,45.85 82.8,45.72 86.61,45.72 | 88.14,65.02 88.14,69.34 86.92,70.56 78.03,70.56 77.47,71.12 | v80.26,34.04 v80.26,45.72 80.01,45.97 v80.01,53.09 | v84.58,37.34 86.87,37.34 91.28,41.75 94.08,41.75 94.29,41.54 94.29,41.53 C13.1 95.18,40.71 | 86.61,45.72 86.68,45.79 C18.1 | 99.06,48.01 v99.06,49.28 | C10.1 74.08,82.87 75.95,81 75.95,80.77 | U3.24 74.57,67.56 | U2.23 75.82,80.14 | 75.82,80.14 75.95,80.26 75.95,80.77 | 77.42,72.84 v77.47,72.9 77.47,71.12 | v76.96,80.26 76.84,80.14 75.82,80.14 | 74.61,69.66 C9.1 | 77.47,71.12 76.01,69.66 C9.1 | 75.95,80.77 75.92,80.8 U2.24 | U3.24 U3.23 | C9.1 74.55,69.28 U3.24 | v80.01,59.94 85.09,65.02 88.14,65.02
  Top 0.61: v106.93,74.93 107.8,74.07 107.8,71.86 108.18,71.48 117.62,71.48 118.28,72.14 123.19,72.14 SV3.1 | U5.3 101.07,31.22 100.08,30.23 100.08,27.94 100.33,27.94 101.67,27.94 C26.1
  Top 0.813: C27.+ 104.9,26.93 104.07,27.75 C26.1 | v92.46,19.16 92.46,21.78 R11.2 R10.2 93.16,24.77 93.16,25.13 94.19,26.16 94.99,26.16 96.27,27.44 96.27,33.23 96.5,33.46 96.5,37.03 C19.1 C13.1 96.52,40.64 97.03,41.15 v97.03,42.16 | 102.71,60.61 C20.1 | C20.1 v106.17,60.71 | v100.33,20.57 100.33,27.94 | v102.95,59 102.8,59.14 C20.1
  Bottom 0.305: SV2.1 128.78,45.97 128.78,36.58 127.51,35.31 SV4.1 127.51,25.6 128.55,24.56 128.55,23.7 127.94,23.09 127.53,23.09 126.47,22.02 126.47,18.62 126.53,18.55 126.53,18.01 R9.2 | v82.68,45.85 80.39,45.85 v80.26,45.72 | v80.26,34.04 81.79,34.04 84.58,36.83 v84.58,37.34 | v80.01,59.94 v80.01,53.09 | v77.47,72.9 77.47,79.76 v76.96,80.26 | v106.93,74.93 SV1.1
  Bottom 0.406: SV3.1 128.78,66.55 128.78,48.51 SV2.1
  Bottom 0.813: v100.33,20.57 96.33,16.58 92.46,16.58 | 92.46,16.58 R7.2 | v92.46,19.16 92.46,16.58 | v97.03,42.16 98.3,42.16 99.06,42.93 v99.06,49.28 99.06,56.92 101.52,59.38 102.42,59.38 102.87,58.93 v102.95,59 | v106.93,74.93 106.17,74.17 v106.17,60.71
5V  (via drill 0.35, 0.5, 0.5 pad 0.65)
  Top 0.305: 65.92,28.56 T2.4 | v67.56,32 67.51,32 | C12.1 68.71,82.74 U2.1 67.56,80.8 v67.32,81.04 | v66.55,69.6 68.51,69.6 C11.1 68.58,67.72 U3.1 | v40.39,61.47 41.21,62.3 C1.2 | v39.62,63.75 39.62,75.44 40.64,76.45 IC1.9
  Top 0.61: Q2.2 65.99,33.53 67.56,33.53 | 67.56,33.53 68.83,34.8 v68.83,37.08 | v67.56,32 67.56,33.53 | T2.4 67.55,28.71 | 67.55,28.71 67.56,28.7 v67.56,29.46 | 67.55,28.71 67.55,27.7 68.33,26.92 C29.1 | C29.1 86.43,19.81 | 86.43,19.81 86.43,6.03 89.71,2.74 132.5,2.74 135.76,6.01 135.76,6.22 SV5.4 SV5.2 | C29.1 86.43,30.29 D17.C | v62.48,40.64 62.48,48.51 v59.94,51.05 62.23,53.34 62.23,60.2 v64.52,62.48 | 86.43,19.81 v90.42,19.81 | U5.1 105.41,35.84 103.66,35.84 103.12,35.31 v102.11,35.31 101.09,35.31 100.23,36.17 100.23,38.51 101.03,39.3 C23.1
  Top 1.016: C23.1 101.85,40.89 102.62,41.66 C22.+
  Bottom 0.305: 39.62,61.47 v39.62,63.75 | C2.2 v59.94,51.05 | v66.55,69.6 66.55,80.26 v67.32,81.04 | 39.62,61.47 v40.39,61.47 | IC2.9 47.23,52.34 40.74,52.34 39.62,53.46 39.62,61.47
  Bottom 0.61: v67.56,32 v67.56,29.46 | v68.83,37.08 66.04,37.08 v62.48,40.64 | v59.94,51.05 58.67,52.32 IC2.9 | v64.52,62.48 66.55,64.52 v66.55,69.6 | v90.42,19.81 91.75,19.81 92.06,20.12 92.85,20.12 93.17,19.81 97.79,19.81 102.11,24.13 v102.11,35.31
24V  (via drill 0.5 pad 0.65, 0.75)
  Top 0.305: C3.1 44.96,67.45 42.3,70.1 IC1.4
  Top 0.508: v80.26,32 81.85,33.59 R13.2
  Top 0.711: v24.38,15.49 22.18,17.69 R12.1
  Top 1.016: v37.08,16.76 v32,16.76 C28.+
  Bottom 0.305: D9.C 34.82,48.01
  Bottom 0.508: 39.5,20.7 39.65,20.85 39.65,24.64 | X3.2 39.65,24.64 | v24.38,15.49 24.38,11.68 | C25.1 37.66,24.64 39.65,24.64
  Bottom 0.61: v80.26,32 80.26,26.42 77.72,23.88 49.32,23.88 48.33,24.87 46.67,24.87 45.67,23.88 U4.IN+ | C4.1 34.82,48.01
  Bottom 0.711: 24.36,15.47 v24.38,15.49
  Bottom 1.016: v37.08,16.76 37.08,18.29 39.5,20.7 42.16,23.37 U4.IN+ | v32,16.76 30.73,16.76
  Bottom 1.27: X4.2 9.12,9.14 12.95,9.14 X5.1 18.03,11.68 | 18.03,11.68 24.38,11.68 25.65,11.68 30.73,16.76 30.73,23.37 | 30.73,23.37 30.73,26.92 | 30.73,26.92 30.73,38.35 | 30.73,38.35 30.73,43.92 D9.C IC2.4 | D11.C 30.73,38.35 | D15.C 32.53,23.37 30.73,23.37 | D13.C 30.73,26.92 | 18.03,11.68 17.78,11.94 17.78,15.24 3.81,29.21 3.81,80.26 7.37,83.82 29.46,83.82 30.73,82.55 30.73,75.18 | 30.73,75.18 30.73,67.56 | 30.73,67.56 30.73,59.94 | 30.73,59.94 30.73,54.37 D7.C 35.56,52.32 37.34,54.1 37.34,68.58 38.86,70.1 IC1.4 | D5.C 30.73,59.94 | D3.C 30.73,67.56 | D1.C 30.73,75.18
A_LSB_U1  (via drill 0.35)
  Top 0.305: U1.41 102.36,55.11 102.92,55.67 110.44,55.67 v111,55.12 | SV1.2 114.3,77.47 v109.98,73.15
  Bottom 0.305: v111,55.12 111.78,55.12 111.96,55.3 111.96,71.17 v109.98,73.15
A_LSB_U2  (via drill 0.5)
  Top 0.305: SV3.2 128.78,66.55 v124.21,66.55 | v116.63,55.02 115.46,56.18 102.66,56.18 102.1,55.61 U1.42
  Bottom 0.305: v116.63,55.02 123.24,61.63 123.24,65.58 v124.21,66.55
A_LSB_U3
  Top 0.305: SV2.2 130.05,47.5 128.78,48.77 124.21,48.77 116.29,56.69 102.41,56.69 101.83,56.11 U1.43
  Bottom 0.305: 130.05,47.5 SV2.2
A_LSB_U4  (via drill 0.5)
  Top 0.305: v120.4,54.61 119.08,54.61 116.5,57.2 101.9,57.2 101.32,56.61 U1.44 | SV4.2 129.01,25.63 127.08,25.63 126.29,26.42 120.9,26.42 v120.9,46.48
  Bottom 0.305: v120.4,54.61 120.4,46.99 v120.9,46.48
B_DIR_V1  (via drill 0.35)
  Top 0.305: U1.39 100.85,54.11 101.34,54.61 102.57,54.61 103.08,55.12 109.47,55.12 v111,53.59
  Bottom 0.305: v111,53.59 111.28,53.88 111.28,53.9 112.47,55.09 112.47,72.19 114.17,73.89 115.49,73.89 116.54,74.93 SV1.3
B_DIR_V2  (via drill 0.5)
  Top 0.305: v113.31,53.57 113.28,53.59 110.24,50.55 98.81,50.55 98.81,54.17 99.25,54.61 U1.40 | SV3.3 123.7,65.28 123.44,65.02 123.44,64.96 123,64.52 122.94,64.52 v122.43,64.01
  Bottom 0.305: v113.31,53.57 113.31,53.99 113.49,54.17 113.49,63.45 114.05,64.01 v122.43,64.01
B_DIR_V3  (via drill 0.5)
  Top 0.305: U1.51 96.98,63.96 97.54,64.52 99.87,64.52 100.37,64.01 109.73,64.01 114.3,59.44 120.65,59.44 122.22,57.86 123.91,57.86 v124.71,58.67
  Bottom 0.305: v124.71,58.67 124.71,51.47 125.98,50.2 125.98,45.47 126.75,44.7 SV2.3
B_DIR_V4  (via drill 0.35, 0.5)
  Top 0.305: v122.68,46.74 122.68,46.54 121.92,45.78 121.92,29.71 v123.44,28.19 | U1.52 96.48,64.23 97.28,65.02 100.08,65.02 100.58,64.52 109.98,64.52 114.55,59.94 121.41,59.94 v122.68,58.67
  Bottom 0.305: v122.68,58.67 122.68,55.43 122.93,55.18 122.93,54.55 122.68,54.3 v122.68,46.74 | v123.44,28.19 123.44,25.15 124.46,24.13 SV4.3
BAT_MEAS
  Top 0.305: R13.1 R14.2 C21.1 87.17,43.43 88.94,45.21 90.68,45.21 91.98,46.52 U1.20
BOOTO  (via drill 0.5)
  Top 0.305: v81.53,67.56 81.53,63.75 80.58,62.8 R8.2 | U1.60 92.48,63.47 92.2,63.75 v89.92,63.75
  Bottom 0.305: v81.53,67.56 81.53,73.48 82.22,74.17 86.87,74.17 89.11,71.93 89.11,68.68 91.18,66.61 91.18,64.71 90.23,63.75 v89.92,63.75
CLK  (via drill 0.35)
  Top 0.305: v133.35,21.08 133.35,20.83 132.84,20.32 130.81,20.32 130.05,21.08 SV4.6 | v133.35,42.67 132.59,43.43 130.56,43.43 130.05,42.93 SV2.6 | U1.61 91.98,62.55 v91.55,62.99 | v133.1,63.25 130.56,63.25 SV3.6
  Bottom 0.305: 120.14,78.49 SV1.6 | v91.55,62.99 92.2,63.64 92.2,67.03 90.13,69.1 90.13,76.54 93.85,80.26 102.38,80.26 102.61,80.04 103.64,80.04 103.86,80.26 104.39,80.26 107.22,77.44 107.22,77.17 107.65,76.74 108.25,76.74 110.03,78.51 118.03,78.51 118.06,78.49 120.14,78.49 | v133.35,21.08 132.59,21.84 132.59,22.33 132.81,22.56 132.81,23.16 132.59,23.39 132.59,39.88 132.87,40.16 133.15,40.16 133.58,40.59 133.58,41.2 133.35,41.42 v133.35,42.67 132.59,43.43 132.59,60.68 133.83,61.93 133.83,62.53 133.12,63.25 v133.1,63.25 133.1,63.5 132.59,64.01 132.59,72.62 126.72,78.49 125.68,78.49 125.65,78.51 122.25,78.51 122.23,78.49 120.14,78.49
CSN  (via drill 0.35)
  Top 0.305: v127.1,77.06 126.24,76.2 121.41,76.2 SV1.5 117.35,72.14 108.46,72.14 108.46,76.96 v107.95,77.47 | v132.84,40.89 128.78,40.89 SV2.5 | v132.08,22.86 128.78,22.86 SV4.5 | U1.62 91.48,61.93 91.44,61.98 v91.19,61.98 | v133.1,62.23 131.01,62.23 130.48,61.7 128.55,61.7 SV3.5
  Bottom 0.305: v107.95,77.47 104.65,80.77 103.65,80.77 103.43,80.55 102.82,80.55 102.59,80.77 93.64,80.77 89.62,76.75 89.62,68.89 91.69,66.82 91.69,64.26 90.81,63.38 90.81,62.69 91.19,62.31 v91.19,61.98 | v127.1,77.06 132.08,72.09 132.08,62.23 | v132.08,22.86 132.08,40.89 | 132.08,40.89 132.08,62.23 | 132.08,62.23 v133.1,62.23 | v132.84,40.89 132.08,40.89
D01  (via drill 0.65)
  Top 0.305: U1.53 95.98,64.49 97.03,65.53 100.29,65.53 100.79,65.02 118.87,65.02 v122.68,68.83
  Bottom 0.305: v122.68,68.83 SV1.7
D02  (via drill 0.35)
  Top 0.305: U1.2 87.43,58.11 85.85,59.69 v84.58,59.69 | v86.87,72.9 90.17,69.6 122.19,69.6 122.32,69.72 123.05,69.72 123.57,69.2 123.57,68.47 121.62,66.52 121.62,63.67 122.09,63.2 122.48,63.2 v124.46,61.21
  Bottom 0.305: v84.58,59.69 86.87,61.98 v86.87,72.9 | v124.46,61.21 126.49,61.21 SV3.7
D03  (via drill 0.35)
  Top 0.305: U1.3 87.17,57.61 85.86,58.92 v83.82,58.92 | v86.11,72.14 86.91,72.14 89.96,69.09 119.38,69.09 v120.14,68.33 | v121.41,73.15 127.51,73.15 133.86,66.8 133.86,43.2 134.08,42.98 134.08,41.1 131.57,38.58 129.62,38.58 128.57,39.62 SV2.7
  Bottom 0.305: v83.82,58.92 83.85,58.95 83.85,59.99 84.28,60.42 84.6,60.42 86.36,62.19 86.36,71.88 v86.11,72.14 | v120.14,68.33 121.41,69.6 v121.41,73.15
D04  (via drill 0.35)
  Top 0.305: U1.4 86.9,57.11 85.83,58.18 v83.06,58.18 | v85.34,71.37 85.65,71.07 87.13,71.07 89.62,68.58 118.36,68.58 v119.38,67.56 | v120.14,73.15 120.88,73.89 121.72,73.89 121.94,73.66 127.72,73.66 134.37,67.01 134.37,43.41 134.59,43.19 134.59,21.29 131.31,18.01 128.55,18.01 SV4.7
  Bottom 0.305: v83.06,58.18 83.09,58.21 83.09,59.95 84.07,60.93 84.39,60.93 85.85,62.4 85.85,70.87 v85.34,71.37 | v119.38,67.56 119.41,67.59 119.41,68.63 120.14,69.36 v120.14,73.15
EN1_UC  (via drill 0.5)
  Top 0.305: U1.22 92.98,45.99 v90.42,43.43 | U2.21 91.72,78.84 v92.95,77.61
  Bottom 0.305: v92.95,77.61 92.86,77.53 92.86,45.87 v90.42,43.43
EN2_UC  (via drill 0.35, 0.5)
  Top 0.305: U1.23 93.48,45.22 v91.69,43.43 | v93.98,76.45 93.63,76.81 92.61,76.81 91.23,78.18 U2.20
  Bottom 0.305: v93.98,76.45 93.37,75.84 93.37,45.11 v91.69,43.43
EN3_UC  (via drill 0.35, 0.5)
  Top 0.305: U2.19 91.15,77.55 93.26,75.44 v95,75.44 | U1.26 94.98,44.97 95,44.96 95,44.2 v95.25,43.94
  Bottom 0.305: v95,75.44 93.88,74.32 93.88,45.31 v95.25,43.94
EN4_UC  (via drill 0.5)
  Top 0.305: U2.18 91.09,76.89 93.56,74.42 v96.01,74.42 | U1.27 95.48,45.74 v96.27,44.96
  Bottom 0.305: v96.01,74.42 94.39,72.8 94.39,45.57 95,44.96 v96.27,44.96
GND  (via drill 0.35, 0.5, 0.5 pad 0.65, 0.65, 0.75)
  Top 0.305: 92.25,58.11 97.54,58.11 | 97.54,58.11 98.3,58.11 | 98.3,58.11 U1.47 | 90.98,59.38 U1.63 | 92.25,58.11 90.98,59.38 | 77.72,58.67 77.72,63.75 78.67,64.7 R8.1 | C24.2 59.94,28.19 58.67,26.92 56.13,26.92 55.81,27.24 | 55.81,27.24 54.54,28.51 T1.2 55.37,30.46 55.37,35.96 54.36,36.97 54.36,38.35 55.31,39.3 R17.1 R18.1 64.7,39.3 C16.1 C15.1 67.56,54.86 67.56,56.13 70.1,58.67 71.63,58.67 | 55.81,27.24 R16.1 38.67,27.24 v38.35,26.92 | R14.1 C21.2 81.85,51.37 83.59,53.11 U1.12 | 77.72,58.67 71.63,58.67 | 87.63,87.63 86.87,88.39 R1.1 82.88,88.4 C5.1 R5.2 76.13,86.04 74.86,84.77 C10.2 70.61,84.77 | 87.63,87.63 C6.1 | 87.63,87.63 88.39,88.39 R2.1 94.48,88.4 95,87.88 | 95,87.88 C7.1 | 95,87.88 95.51,88.4 R3.1 101.85,88.39 102.62,87.63 | 102.62,87.63 C8.1 | R4.1 | R4.1 103.38,88.4 102.62,87.63 | 92.25,58.11 92.25,55.23 90.14,53.11 | C20.2 99.38,59.18 98.3,59.18 98.3,58.11 | C13.2 C19.2 93.28,36.52 D17.A 95,33.77 v95,32 95,27.24 94.68,26.92 C29.2 | U1.18 90.98,48.57 | U1.18 90.98,47.8 90.17,46.99 C18.2 | U1.12 89.22,53.11 | 106.67,88.4 R4.1 | 90.14,53.11 90.98,52.27 U1.18 | U1.12 90.14,53.11 | U2.13 74.52,73.66 74.5,73.64 71.63,73.64 | 71.63,73.64 U2.12 68.68,73.66 | 71.63,74.17 71.63,80.77 70.61,81.79 70.61,84.77 | 71.63,74.17 71.63,73.64 | U2.11 71.5,74.3 71.63,74.17 | U3.12 71.63,60.43 | 71.63,60.43 U3.13 | 71.63,60.43 71.63,58.67 | U3.11 70.1,61.09 | 70.1,61.09 70.97,61.09 71.63,60.43 | 74.49,71.88 C9.2 | R6.2 71.37,71.63 | 68.51,71.63 C11.2 R6.2 | C1.1 43.25,64.2 43.69,63.75 43.69,62.99 44.38,62.3 C3.2 44.96,60.96 44.45,60.45 44.45,52.07 43.43,51.05 IC2.8 | C12.2 70.61,84.77 | 70.1,61.09 70.1,62.99 v72.39,65.28 | v76.2,71.12 75.76,71.56 C9.2
  Top 0.305: C9.2 71.63,71.56 | 71.63,71.56 R6.2 | 71.63,73.64 71.63,71.56 | 97.54,58.11 97.48,58.06 U1.31 97.48,47.11 99.57,45.02 | 77.72,58.67 77.98,58.67 78.51,59.21 80.31,59.21 82.57,61.47 C14.2 86.93,60.13 87.63,59.44 90.93,59.44 90.98,59.38 | v99.57,32 99.57,45.02 | 99.57,45.02 C17.2
  Top 0.61: LED1.C 20.57,7.11 20.07,6.6 X5.2
  Top 0.813: U5.2 U5.4
  Top 1.016: C28.- v32,2.79 | v102.11,20.57 109.22,20.57 111,22.35 C27.- 112.01,25.4 115.47,28.85 115.47,29.46 | 115.47,29.46 U5.4 115.47,37.34 | C22.- 113.79,41.66 115.47,39.98 115.47,37.34 | C23.2 115.4,37.4 115.47,37.34 | C26.2 115.28,29.65 115.47,29.46
  Bottom 0.305: v95,32 v99.57,32 | C2.1 45.47,51.05 44.13,49.72 | v72.39,65.28 76.2,69.09 v76.2,71.12 | C4.2 37.78,47.24 44.67,47.24
  Bottom 0.508: v38.35,26.92 35.05,26.92 | C25.2 37.53,22.61 35.05,22.61
  Bottom 0.61: 130.3,12.95 130.05,13.21 SV4.10 131.32,17.78 131.32,22.37 131.19,22.49 131.19,23.23 131.32,23.35 131.32,35.81 SV2.10 130.3,37.08 131.32,38.1 131.32,56.39 SV3.10 130.3,57.66 131.32,58.67 131.32,71.37 SV1.10
  Bottom 1.016: 42.16,2.79 v32,2.79 28.25,2.79 24.41,6.63 | 42.16,2.79 79.5,2.79 81.79,5.08 U4.OUT- 87.88,6.6 | X5.2 19.3,6.6 | 87.88,6.6 SV5.39 91.88,10.59 91.88,12.09 101.6,12.09 | 87.88,6.6 87.88,4.32 89.66,2.54 97.28,2.54 98.04,3.3 | 98.04,3.3 SV5.34 | 98.04,3.3 98.81,2.54 103.12,2.54 | 103.12,2.54 SV5.30 | SV5.25 108.2,11.43 107.54,12.09 101.6,12.09 | 103.12,2.54 115.82,2.54 | 115.82,2.54 SV5.20 | 115.82,2.54 123.44,2.54 | 123.44,2.54 SV5.14 | 123.44,2.54 133.6,2.54 | 133.6,2.54 SV5.6 | SV5.9 128.52,12.95 130.3,12.95 140.97,12.95 140.97,2.54 133.6,2.54 | 35.05,41.4 35.81,40.64 43.43,40.64 43.43,41.52 44.67,42.77 44.67,47.24 44.67,49.18 44.13,49.72 43.73,50.12 43.09,50.12 IC2.8 | 101.6,12.09 102.11,12.6 v102.11,20.57 | 42.16,2.79 U4.IN-
  Bottom 1.27: X4.1 8.66,5.36 9.91,6.6 X5.2 | D8.A 35.56,58.91 35.56,63.75 | 35.56,78.99 35.56,79.81 30.07,85.29 6.76,85.29 2.34,80.87 2.34,3 3.56,1.78 17.27,1.78 19.3,3.81 19.3,6.6 24.38,6.6 24.41,6.63 26.04,8.25 35.05,17.27 35.05,19.3 | 35.56,78.99 35.56,75.18 | 35.56,75.18 35.56,71.37 | 35.56,71.37 35.56,63.75 | D6.A 35.56,63.75 | D4.A 35.56,71.37 | D2.A 35.56,78.99 | IC1.8 35.56,75.18 | 35.05,34.54 35.05,41.4 34.29,42.16 D10.A | 35.05,34.54 35.05,30.73 | 35.05,30.73 35.05,26.92 35.05,22.61 35.05,19.3 | D12.A 35.05,34.54 | D14.A 35.05,30.73 | D16.A 35.05,19.3
  pour Top (isolate 0.254): -5.33,95 148.08,95 148.08,-3.05 -5.33,-3.05
IN11  (via drill 0.35)
  Top 0.305: v56.13,68.58 58.93,68.58 61.21,66.29 U3.3
  Bottom 0.305: v56.13,68.58 56.13,70.87 55.63,71.37 IC1.5
IN11_UC  (via drill 0.35, 0.5)
  Top 0.305: U3.21 75.31,65.63 76.71,67.04 76.71,67.56 78.74,69.6 82.83,69.6 84.55,67.87 84.55,67.85 v84.84,67.56 | v83.82,55.63 84.33,55.11 U1.8
  Bottom 0.305: v83.82,55.63 83.31,55.63 82.04,56.9 82.04,58.78 82.27,59.01 82.27,60.88 82.04,61.1 82.04,64.77 84.1,66.83 84.12,66.83 84.55,67.26 84.55,67.28 v84.84,67.56
IN12  (via drill 0.35)
  Top 0.305: v56.9,67.82 58.93,67.82 61.11,65.63 U3.4
  Bottom 0.305: IC1.7 54.65,73.91 56.9,71.67 v56.9,67.82
IN12_UC  (via drill 0.35, 0.5)
  Top 0.305: U3.20 75.39,64.97 77.22,66.8 77.22,67.35 78.95,69.09 82.32,69.09 83.54,67.87 83.54,67.85 v83.82,67.56 | U1.9 83.05,54.61 v82.8,54.86
  Bottom 0.305: v82.8,54.86 81.79,54.86 81.53,55.12 81.53,58.99 81.76,59.22 81.76,60.67 81.53,60.89 81.53,65.28 83.09,66.83 83.11,66.83 83.54,67.26 83.54,67.28 v83.82,67.56
IN21  (via drill 0.35)
  Top 0.305: v57.66,67.06 58.7,67.06 59.15,66.6 59.15,66.58 60.76,64.97 U3.5
  Bottom 0.305: IC1.10 43.43,77.72 44.96,76.2 44.96,75.69 45.47,75.18 54.1,75.18 57.66,71.63 v57.66,67.06
IN21_UC  (via drill 0.35, 0.5)
  Top 0.305: U3.19 75.51,64.34 77.72,66.55 77.72,67.14 79.16,68.58 81.79,68.58 v82.8,67.56 | v82.04,53.85 83.06,53.85 83.33,54.11 U1.10
  Bottom 0.305: v82.04,53.85 81.53,53.85 81.03,54.36 81.03,59.2 81.25,59.43 81.25,60.46 81.03,60.68 81.03,65.79 v82.8,67.56
IN22  (via drill 0.35)
  Top 0.305: v58.42,66.29 60.38,64.34 U3.6
  Bottom 0.305: IC1.12 43.18,80.26 44.2,79.25 44.2,78.74 45.21,77.72 52.32,77.72 58.42,71.63 v58.42,66.29
IN22_UC  (via drill 0.35, 0.5)
  Top 0.305: U1.11 83.55,53.61 82.76,52.83 v81.28,52.83 | U3.18 75.57,63.68 78.44,66.55 v80.52,66.55
  Bottom 0.305: v81.28,52.83 81.28,53.34 80.52,54.1 80.52,59.41 80.74,59.64 80.74,60.25 80.52,60.47 v80.52,66.55
IN31  (via drill 0.35)
  Top 0.305: v53.09,47.75 53.09,61.67 53.34,61.93 53.34,74.93 55.27,76.86 65.55,76.86 65.58,76.89 U2.7
  Bottom 0.305: IC2.5 52.58,47.24 v53.09,47.75
IN31_UC  (via drill 0.35, 0.5)
  Top 0.305: U1.24 93.98,44.96 92.71,43.69 v92.71,42.67 | v97.03,73.41 93.86,73.41 91.01,76.25 U2.17
  Bottom 0.305: v92.71,42.67 93.17,43.13 95.59,43.13 97.08,44.62 97.08,45.29 96.6,45.77 95.61,45.77 94.89,46.48 94.89,60.71 94.89,71.27 v97.03,73.41
IN32  (via drill 0.35)
  Top 0.305: v54.1,48.77 53.59,49.28 53.59,61.46 53.85,61.72 53.85,74.68 55.42,76.25 U2.8
  Bottom 0.305: IC2.7 53.09,49.78 v54.1,48.77
IN32_UC  (via drill 0.35, 0.5)
  Top 0.305: U1.25 94.48,44.7 93.73,43.94 93.73,43.43 v95,42.16 | U2.16 90.95,75.59 93.87,72.67 97.76,72.67 v98.04,72.39
  Bottom 0.305: v95,42.16 95.46,42.62 95.8,42.62 97.58,44.41 97.58,45.5 96.81,46.27 95.86,46.27 95.4,46.74 95.4,69.75 v98.04,72.39
IN41  (via drill 0.35)
  Top 0.305: U2.9 55.48,75.59 54.36,74.47 54.36,64.01 55.37,62.99 v55.37,62.48
  Bottom 0.305: IC2.10 43.43,53.59 45.09,55.25 45.09,60.46 45.82,61.2 54.09,61.2 v55.37,62.48
IN41_UC  (via drill 0.35)
  Top 0.305: U1.37 104.42,53.11 v104.65,53.34 | v99.06,71.37 94.45,71.37 90.91,74.91 74.57,74.91 U2.15
  Bottom 0.305: v104.65,53.34 103.89,54.1 103.89,61.21 97.28,67.82 97.28,69.6 v99.06,71.37
IN42  (via drill 0.35)
  Top 0.305: v56.39,63.5 55.63,63.5 54.86,64.26 54.86,74.26 55.54,74.93 U2.10
  Bottom 0.305: IC2.12 43.45,57.42 43.58,57.42 44.58,58.41 44.58,60.67 45.61,61.71 53.59,61.71 54.64,62.75 54.64,62.79 55.35,63.5 v56.39,63.5
IN42_UC  (via drill 0.35)
  Top 0.305: U1.38 102.64,53.61 103.38,54.36 v105.66,54.36 | U2.14 90.81,74.3 94.74,70.36 v100.08,70.36
  Bottom 0.305: v105.66,54.36 104.39,55.63 104.39,61.42 98.3,67.52 98.3,68.58 v100.08,70.36
INDEX_W1  (via drill 0.35)
  Top 0.305: U1.33 109.79,51.11 v112.01,53.59
  Bottom 0.305: v112.01,53.59 112.98,54.56 112.98,71.58 114.55,73.15 117.6,73.15 118.87,74.42 118.87,76.2 SV1.4
INDEX_W2  (via drill 0.35, 0.5)
  Top 0.305: v121.67,54.61 125.73,58.42 125.73,61.98 126.47,62.71 126.47,63.17 127.08,63.78 127.53,63.78 129.03,65.28 SV3.4 | U1.34 109.27,51.61 109.73,52.07 v109.69,52.1
  Bottom 0.305: v121.67,54.61 121.92,54.86 121.66,55.12 121.66,55.18 121.21,55.63 118.05,55.63 117.61,55.18 117.61,53.85 115.82,52.07 111.51,52.07 110.97,52.61 110.19,52.61 v109.69,52.1
INDEX_W3  (via drill 0.35)
  Top 0.305: U1.35 107.99,52.11 108.2,52.32 v108.2,52.35 | v123.44,45.47 124.21,44.7 126.07,44.7 126.47,45.1 126.47,45.13 127.08,45.74 127.94,45.74 128.98,44.7 SV2.4
  Bottom 0.305: v108.2,52.35 108.45,52.1 108.45,51.59 109.18,50.86 109.69,50.86 109.98,50.57 109.98,46.92 111.48,45.41 118.32,45.41 118.37,45.47 v123.44,45.47
INDEX_W4  (via drill 0.35, 0.5)
  Top 0.305: v118.11,46.48 118.11,26.42 121.44,23.09 128.29,23.09 129.33,24.13 SV4.4 | U1.36 107.48,52.61 108.46,53.59 v109.73,53.59
  Bottom 0.305: v118.11,46.48 118.11,45.92 111.7,45.92 111.7,50.03 110.36,51.37 109.39,51.37 108.96,51.8 108.96,52.41 109.73,53.18 v109.73,53.59
LED  (via drill 0.5 pad 0.65)
  Top 0.305: R15.2 53.76,39.47 53.76,40.08 54.57,40.89 v59.94,40.89 | v85.34,42.16 86.61,42.16 89.15,44.7 90.93,44.7 92.48,46.26 U1.21
  Bottom 0.305: v59.94,40.89 61.41,40.89 62.17,41.65 62.8,41.65 65.58,38.87 82.05,38.87 v85.34,42.16
MOT11  (via drill 0.5 pad 0.65)
  Top 0.61: v24.38,75.18 24.38,62.48 39.71,62.48 40.59,63.36 40.59,65.98 IC1.2
  Bottom 0.61: v24.38,75.18 D1.A
  Bottom 1.016: D1.A D2.C 16.76,78.99 11.68,73.91 X1.4
MOT12  (via drill 0.5 pad 0.65)
  Top 0.508: 51.05,82.82 51.05,85.85 50.55,86.36 24.64,86.36 23.11,84.84 v23.11,67.56
  Top 0.61: 51.05,82.82 50.14,81.91 50.14,81.16 51.05,80.25 51.05,68.83 IC1.3
  Bottom 0.61: v23.11,67.56 D3.A
  Bottom 1.016: D3.A D4.C 14.26,71.37 X1.3
MOT21  (via drill 0.5 pad 0.65)
  Top 0.508: v51.56,81.53 51.56,82.25 51.82,82.51 51.82,86.87 51.31,87.38 23.62,87.38 22.2,85.96 22.2,67.19 22.61,66.78 22.61,64.26 v23.11,63.75
  Bottom 0.61: IC1.13 v51.56,81.53 | v23.11,63.75 D6.C
  Bottom 1.016: D6.C D5.A 14.22,59.94 11.68,62.48 X1.2
MOT22  (via drill 0.55 pad 0.65)
  Top 0.61: v38.35,88.31 38.18,88.14 22.48,88.14 21.44,87.1 21.44,66.87 21.84,66.47 v21.84,56.13
  Bottom 0.61: IC1.14 38.35,82.8 v38.35,88.31 | v21.84,56.13 D8.C
  Bottom 1.016: D8.C D7.A 16.76,52.32 11.68,57.4 X1.1
MOT31  (via drill 0.55 pad 0.65)
  Top 0.61: v26.92,48.51 37.08,48.51 37.08,43.43 IC2.2
  Bottom 0.61: v26.92,48.51 26.92,44.7
  Bottom 1.016: D10.C 28.68,44.7 | 28.68,44.7 D9.A | X2.4 15.61,44.7 26.92,44.7 28.68,44.7
MOT32  (via drill 0.55 pad 0.65)
  Top 0.61: v25.65,39.62 44.7,39.62 44.7,44.7 IC2.3
  Bottom 0.61: v25.65,39.62 25.65,37.08
  Bottom 1.016: D11.A 28.68,37.08 | 28.68,37.08 D12.C | X2.3 12.95,37.04 12.95,37.08 25.65,37.08 28.68,37.08
MOT41  (via drill 0.55 pad 0.65)
  Top 0.61: v25.65,34.54 29.46,38.35 51.05,38.35 51.05,57.4 IC2.13
  Bottom 0.61: v25.65,34.54 25.65,29.46
  Bottom 1.016: D14.C 28.68,29.46 | 28.68,29.46 D13.A | X2.2 12.99,29.46 25.65,29.46 28.68,29.46
MOT42  (via drill 0.55 pad 0.65)
  Top 0.61: v24.38,23.11 24.38,59.94 42.16,59.94 IC2.14
  Bottom 0.61: v24.38,23.11 D15.A
  Bottom 1.016: D15.A 28.68,20.57 | 28.68,20.57 D16.C | X2.1 16.88,20.57 28.68,20.57
N$1  (via drill 0.65)
  Top 1.016: F1.2 77.47,30.48 v82.3,30.48
  Bottom 1.016: v82.3,30.48 82.3,24.38 U4.OUT+
N$2
  pour Bottom (isolate 0.254): -4.06,94.23 145.54,94.23 145.54,-1.78 -4.06,-1.78
N$3
  Top 0.711: LED1.A R12.2
N$4  (via drill 0.35)
  Top 0.305: 77.22,82.04 R5.1 | U2.2 67.18,80.14 66.04,81.28 v66.04,81.53 | v75.95,82.04 77.22,82.04 | U2.22 74.58,79.53 77.27,79.53 77.7,79.96 77.7,80.57 77.22,81.05 77.22,82.04
  Bottom 0.305: v66.04,81.53 66.55,82.04 v75.95,82.04
N$5
  Top 0.305: R6.1 71.37,67.31 | 71.37,67.31 70.99,66.93 U3.2 | U3.22 72.39,66.29 71.37,67.31
N$6
  Top 0.305: C24.1 60.01,30.48 63.86,30.48 T2.1 | 70.36,30.99 F1.1
  Top 0.61: F1.1 66.72,30.73 66.43,31.02 65.24,31.02 | 65.24,31.02 65.02,31.24 Q2.3 | T2.1 64.12,30.6 64.55,31.02 65.24,31.02
N$19  (via drill 0.5)
  Top 0.305: T2.3 63.6,28.19 v62.48,28.19 | 61.21,33.22 v61.21,32 | Q2.1 63.75,33.22 61.21,33.22 | R18.2 61.21,34.86 61.21,33.22
  Bottom 0.305: v62.48,28.19 61.21,29.46 v61.21,32
N$20  (via drill 0.5)
  Top 0.305: v59.94,34.54 57.72,34.54 55.88,36.39 R17.2 | v62.48,29.46 T2.2 65.02,29.46 T2.5 T2.6
  Bottom 0.305: v59.94,34.54 62.48,34.54 v62.48,29.46
N$21
  Top 0.305: T1.1 52.15,29.14 R16.2 R15.1
N$24  (via drill 0.5)
  Top 0.305: v53.59,34.04 T1.3
  Bottom 0.305: X3.1 46.71,34.04 v53.59,34.04
NRST  (via drill 0.5)
  Top 0.305: SV5.12 124.48,8.1 123.01,8.1 122.4,8.71 122.4,12.65 117.71,17.34 91.09,17.34 v90.4,16.65 | U1.7 85.61,55.61 v85.09,56.13
  Bottom 0.305: R7.1 86.87,13.02 86.87,16.51 | v90.4,16.65 87,16.65 86.87,16.51 | v85.09,56.13 85.6,55.63 85.85,55.63 85.85,42.8 86.15,42.5 86.15,41.83 85.85,41.53 85.85,17.53 86.87,16.51
OSC_IN
  Top 0.305: U1.5 86.64,56.61 85.81,57.45 75.18,57.45 | 75.18,57.45 72.37,57.45 C15.2 | Q1.2 75.18,57.45
OSC_OUT
  Top 0.305: C16.2 75.18,42.16 Q1.1 75.18,39.62 78.99,39.62 78.99,53.59 82.34,56.94 85.55,56.94 86.38,56.11 U1.6
PWM_SIGNAL1  (via drill 0.35)
  Top 0.305: v53.85,80.26 65.79,80.26 66.55,79.5 U2.3
  Bottom 0.305: IC1.6 43.45,73.93 43.58,73.93 44.45,74.79 44.45,75.69 43.69,76.45 40.64,76.45 39.88,77.22 39.88,80.77 40.64,81.53 44.2,81.53 45.47,80.26 v53.85,80.26
PWM_SIGNAL2  (via drill 0.35)
  Top 0.305: v53.85,78.74 54.1,78.49 65.02,78.49 65.38,78.84 U2.4
  Bottom 0.305: IC1.11 53.59,78.99 v53.85,78.74
PWM_SIGNAL3
  Top 0.305: IC2.6 43.45,49.8 43.58,49.8 44.96,51.17 44.96,57.79 45.85,58.69 48.66,58.69 52.32,62.35 52.32,75.44 54.86,77.98 65.23,77.98 65.44,78.18 U2.5
PWM_SIGNAL4  (via drill 0.35)
  Top 0.305: v51.05,58.67 51.05,60.36 52.83,62.14 52.83,75.23 54.97,77.37 65.34,77.37 65.52,77.55 U2.6
  Bottom 0.305: IC2.11 49.53,54.86 51.05,56.39 v51.05,58.67
RPI_CLK  (via drill 0.35)
  Top 0.305: v107.36,65.86 106.92,66.29 97.03,66.29 95,64.26 95,60.58 U1.55
  Bottom 0.305: v107.36,65.86 107.36,54.52 105.66,52.83 105.66,21.34 110.74,16.26 SV5.23
RPI_MISO  (via drill 0.35)
  Top 0.305: v108.42,65.86 107.47,66.8 97.79,66.8 97.54,66.8 96.82,66.8 94.49,64.47 94.49,63.5 94.48,63.5 | U1.56 94.48,63.5 | 94.48,63.5 94.48,63.75
  Bottom 0.305: v108.42,65.86 108.42,54.82 106.17,52.58 106.17,21.97 113.28,14.86 SV5.21
RPI_MOSI  (via drill 0.35)
  Top 0.305: U1.57 93.98,63.75 | 93.98,63.75 | v109.47,65.86 108.02,67.31 96.52,67.31 93.98,64.77 93.98,63.75
  Bottom 0.305: v109.47,65.86 109.47,55.12 106.68,52.32 106.68,22.35 115.82,13.21 SV5.19
RPI_RXD  (via drill 0.5)
  Top 0.305: U1.58 93.48,65.77 92.96,66.29 v89.92,66.29 | SV5.10 127.03,8.1 125.55,8.1 124.94,8.71 124.94,10.82 117.92,17.85 90.03,17.85 v89.73,17.55
  Bottom 0.305: v89.92,66.29 87.88,64.26 87.88,58.17 87.88,18.54 88.88,17.55 v89.73,17.55
RPI_TXD  (via drill 0.5)
  Top 0.305: U1.59 92.98,64.5 92.46,65.02 v89.92,65.02 | SV5.8 129.56,8.1 128.09,8.1 127.48,8.71 127.48,10.18 123.7,13.97 122.52,13.97 118.13,18.36 89.34,18.36 v89.15,18.54
  Bottom 0.305: v89.92,65.02 89.11,64.22 89.11,52.62 89.15,52.58 v89.15,18.54
SCL
  Top 0.305: U1.29 96.48,46.52 98.04,44.96 98.04,21.84 | SV5.5 128.27,14.48 122.73,14.48 118.34,18.86 99.55,18.86 98.04,20.36 98.04,21.84 | 98.04,21.84 R11.1
SDA  (via drill 0.5)
  Top 0.305: U1.30 96.98,46.78 98.55,45.21 98.55,24.13 | SV5.3 136.14,14.99 122.94,14.99 118.55,19.37 99.76,19.37 98.55,20.57 98.55,24.13 | 98.55,24.13 v98.85,24.13 | v97.23,24.13 R10.1
  Bottom 0.305: v98.85,24.13 v97.23,24.13
SEN1  (via drill 0.35, 0.5, 0.5 pad 0.65)
  Top 0.305: v58.17,61.72 v58.17,58.93 | C5.2 80.52,82.31 v81.2,81.63 82.37,82.8 R1.2 | U1.14 85.13,52.11 v84.07,51.05
  Bottom 0.305: v84.07,51.05 68.83,51.05 61.21,58.67 58.42,58.67 v58.17,58.93 | IC1.1 55.37,66.29 58.17,63.5 v58.17,61.72 59.56,61.72 59.61,61.67 70.57,61.67 79.98,71.09 79.98,80.41 v81.2,81.63
SEN2  (via drill 0.35, 0.5)
  Top 0.305: v59.94,62.48 v59.94,57.4 | C6.2 87.63,82.55 90.94,82.55 R2.2 88.91,80.52 79.76,80.52 79.25,81.03 v79.25,81.53 | U1.15 85.9,51.61 v84.07,49.78
  Bottom 0.305: IC1.15 54.86,84.07 55.37,83.57 59.94,83.57 | v79.25,81.53 79.25,82.8 78.49,83.57 59.94,83.57 | v59.94,57.4 65.48,51.86 67.31,51.86 68.62,50.55 83.31,50.55 v84.07,49.78 | v59.94,62.48 59.94,83.57
SEN3  (via drill 0.35, 0.5, 0.5 pad 0.65)
  Top 0.305: v66.29,51.05 v66.29,57.4 | 95.5,82.8 95.26,82.8 95,83.06 C7.2 | 95.5,82.8 R3.2 | v95.5,81.79 95.5,82.8 | U1.16 86.93,51.11 v84.07,48.26
  Bottom 0.305: IC2.1 59.94,42.16 66.29,48.51 | 66.29,48.51 v66.29,51.05 | v66.29,57.4 66.29,59.94 67.01,60.66 70.99,60.66 79.2,68.88 81,70.67 81,73.66 82.01,74.68 86.82,74.68 93.94,81.79 v95.5,81.79 | v84.07,48.26 66.55,48.26 66.29,48.51
SEN4  (via drill 0.35, 0.5)
  Top 0.305: C8.2 102.62,83.31 103.13,82.8 | 103.13,82.8 R4.2 | v103.12,81.28 103.12,82.79 103.13,82.8 | U1.17 90.48,48.32 90.42,48.26 85.34,48.26 v84.07,46.99
  Bottom 0.305: 62.77,59.46 63.24,58.99 63.24,57.92 66.6,54.56 66.6,54.46 69.25,51.81 75.18,51.81 75.23,51.86 84.41,51.86 84.88,51.39 84.88,47.8 v84.07,46.99 | 62.77,59.46 62.29,59.94 51.31,59.94 51.16,59.94 IC2.15 | v103.12,81.28 99.06,81.28 97.79,82.55 93.98,82.55 86.61,75.18 81.79,75.18 80.49,73.89 80.49,70.88 70.78,61.17 64.47,61.17 62.77,59.46
SPI1_NSS  (via drill 0.5)
  Top 0.305: U1.50 97.48,63.7 97.79,64.01 99.66,64.01 100.16,63.5 109.52,63.5 113.54,59.48 | 113.54,59.48 113.54,59.44 | 113.54,59.48 114.09,58.93 117.23,58.93 117.73,58.42 v118.62,58.42 | v115.82,44.61 v115.82,53.59
  Bottom 0.305: v115.82,53.59 115.82,54.67 115.82,54.68 115.82,55.35 118.62,58.15 v118.62,58.42 | SV5.24 111.81,6.6 112.85,7.64 119.41,7.64 SV5.15 120.9,10.48 R9.1 124.07,15.44 122.65,15.44 115.82,22.27 v115.82,44.61
SWCLK  (via drill 0.5)
  Top 0.305: v117.09,57.92 116.59,58.42 113.84,58.42 113.03,59.23 113.03,59.27 109.31,62.99 99.95,62.99 99.45,63.5 98.04,63.5 97.98,63.44 U1.49 | v114.55,53.59 v114.55,44.61 | v117.09,11.68 117.09,5.84 116.59,5.33 114.55,5.33 SV5.22
  Bottom 0.305: v114.55,53.59 114.55,57.15 115.32,57.91 v117.09,57.91 v117.09,57.92 | v114.55,44.61 114.55,15.75 117.09,13.21 v117.09,11.68
SWDIO  (via drill 0.5)
  Top 0.305: U1.46 101.3,57.61 101.96,58.27 v101.96,58.31 | v114.66,3.7 v116.99,3.7
  Bottom 0.305: v101.96,58.31 101.96,44.34 104.39,41.91 104.39,14.48 105.92,12.95 107.9,12.95 109.47,11.38 109.47,4.06 109.83,3.7 v114.66,3.7 | v116.99,3.7 118.36,5.08 SV5.18

### Text on the board
Top: SCORPIO JUNIOR BOARD